# EAGLE schematic raspi_zero_power_sensor_hat (EAGLE 7.7.0)
Assembly variants: POR, PCB_ONLY

## Sheet 1 of 7: TITLE_TOC
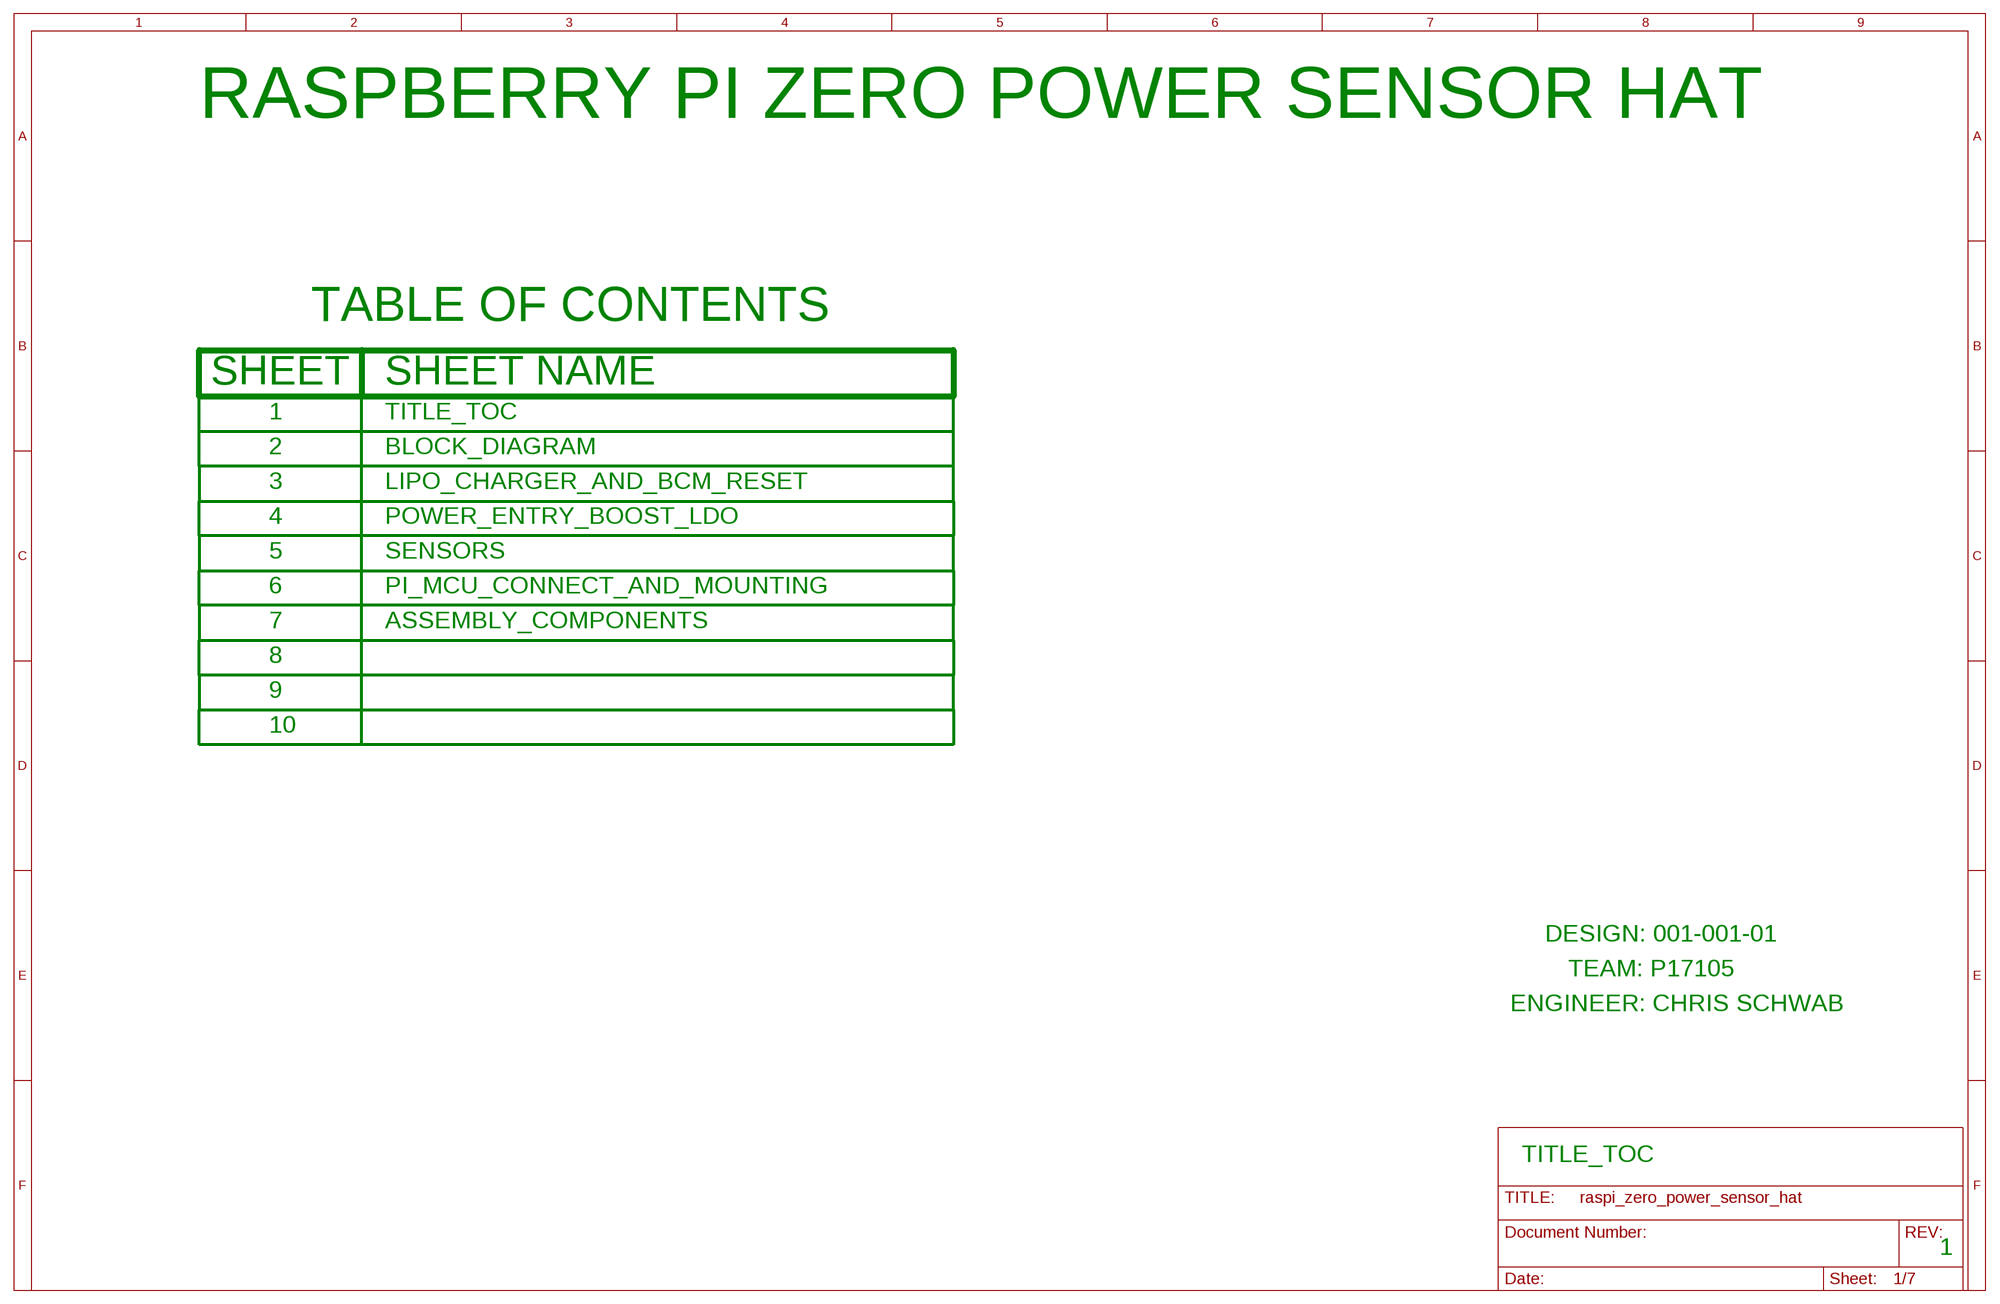
[diagram p0: schematic, sheet 1]

### Notes on the sheet
- RASPBERRY PI ZERO POWER SENSOR HAT
- TITLE_TOC
- BLOCK_DIAGRAM
- LIPO_CHARGER_AND_BCM_RESET
- POWER_ENTRY_BOOST_LDO
- SENSORS
- PI_MCU_CONNECT_AND_MOUNTING
- ASSEMBLY_COMPONENTS
- DESIGN: 001-001-01
- TEAM: P17105
- ENGINEER: CHRIS SCHWAB
- TITLE_TOC
- 1

## Sheet 2 of 7: BLOCK_DIAGRAM
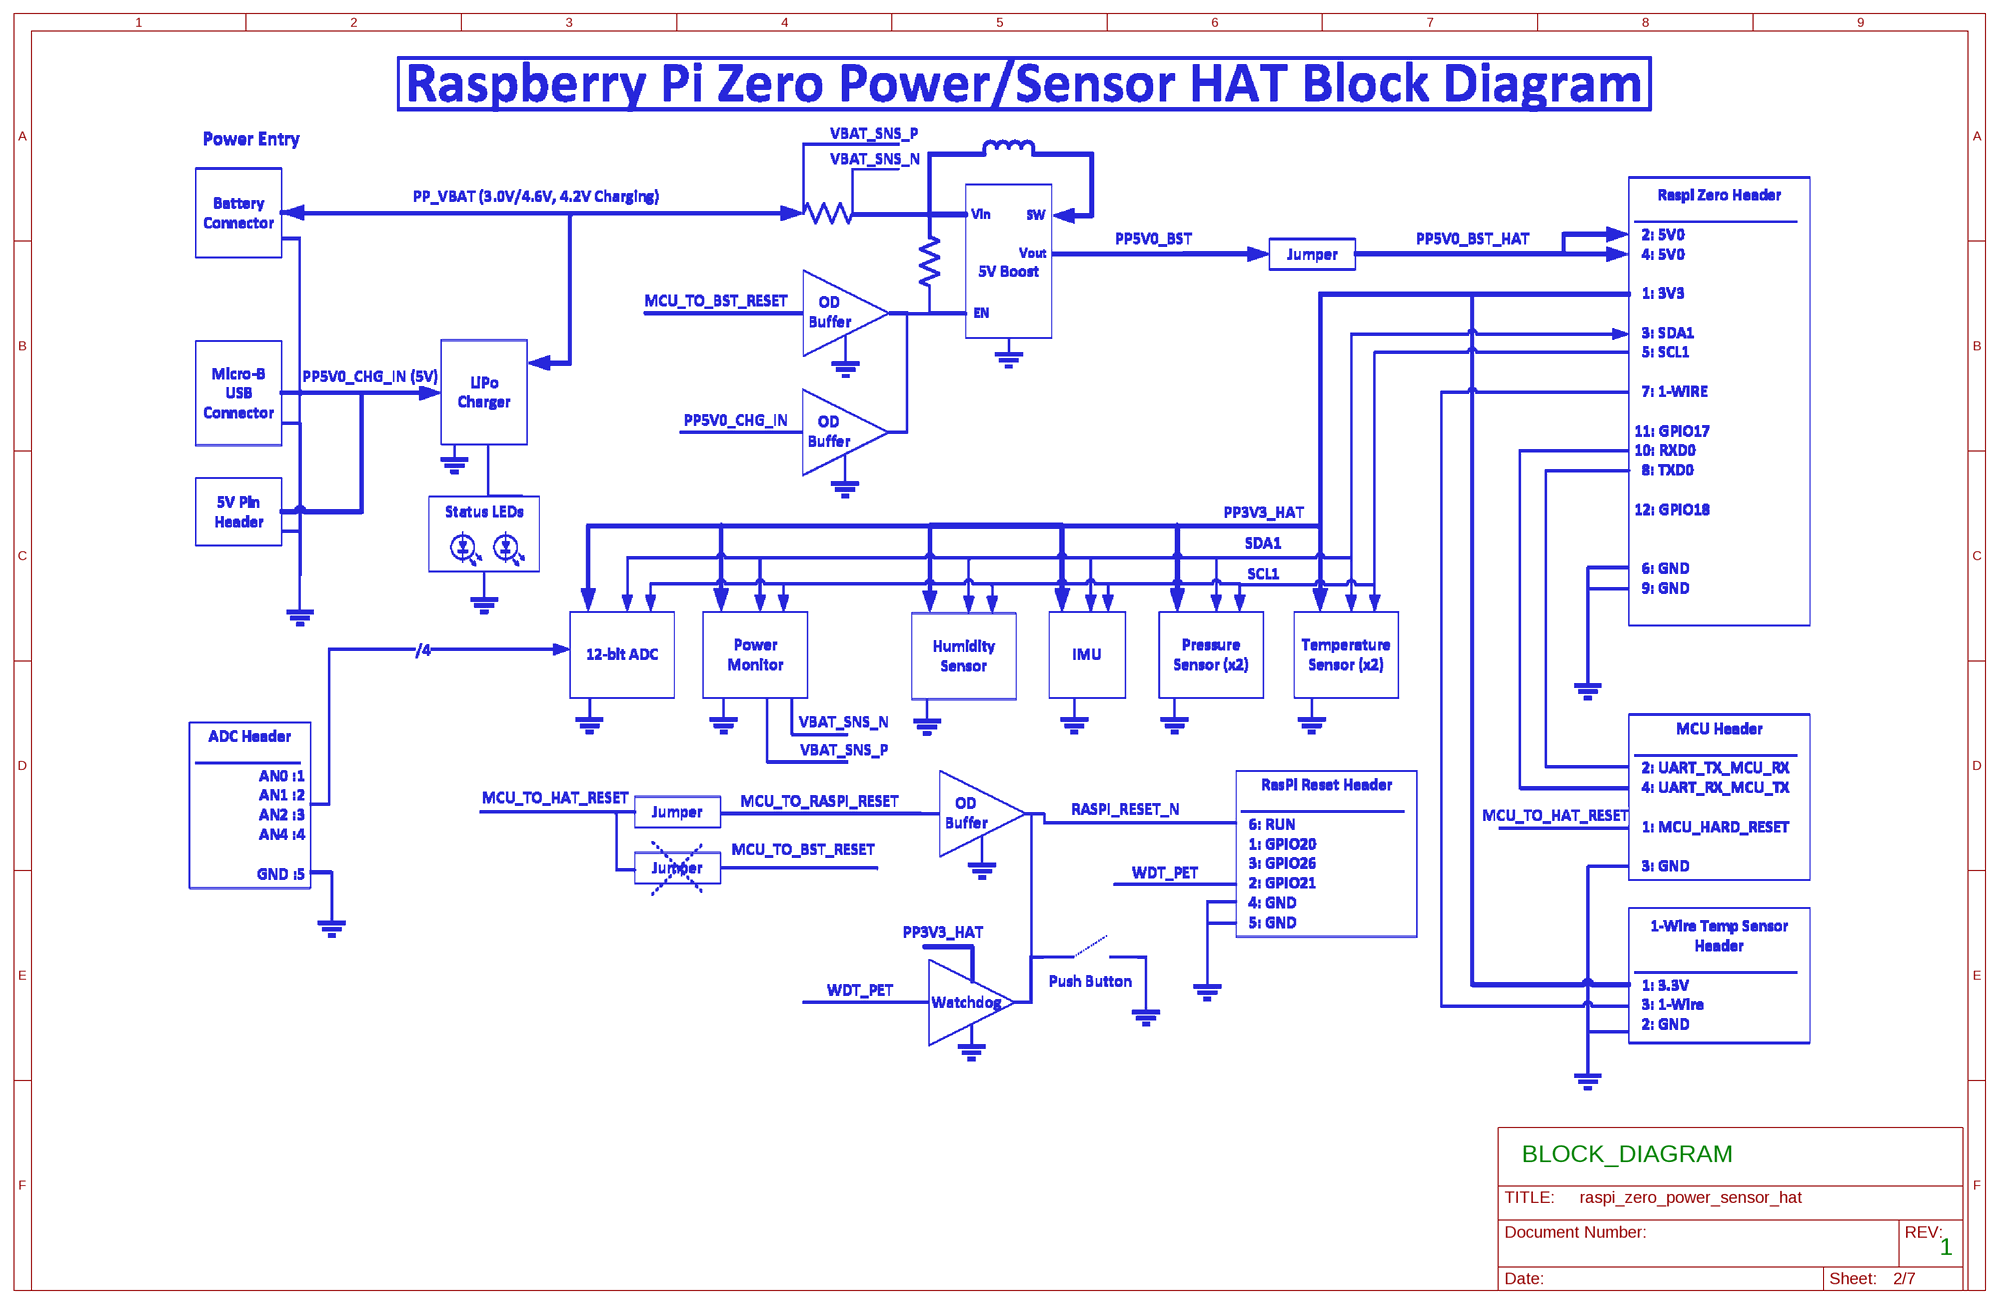
[diagram p1: schematic, sheet 2]

### Notes on the sheet
- BLOCK_DIAGRAM
- 1

## Sheet 3 of 7: LIPO_CHARGER
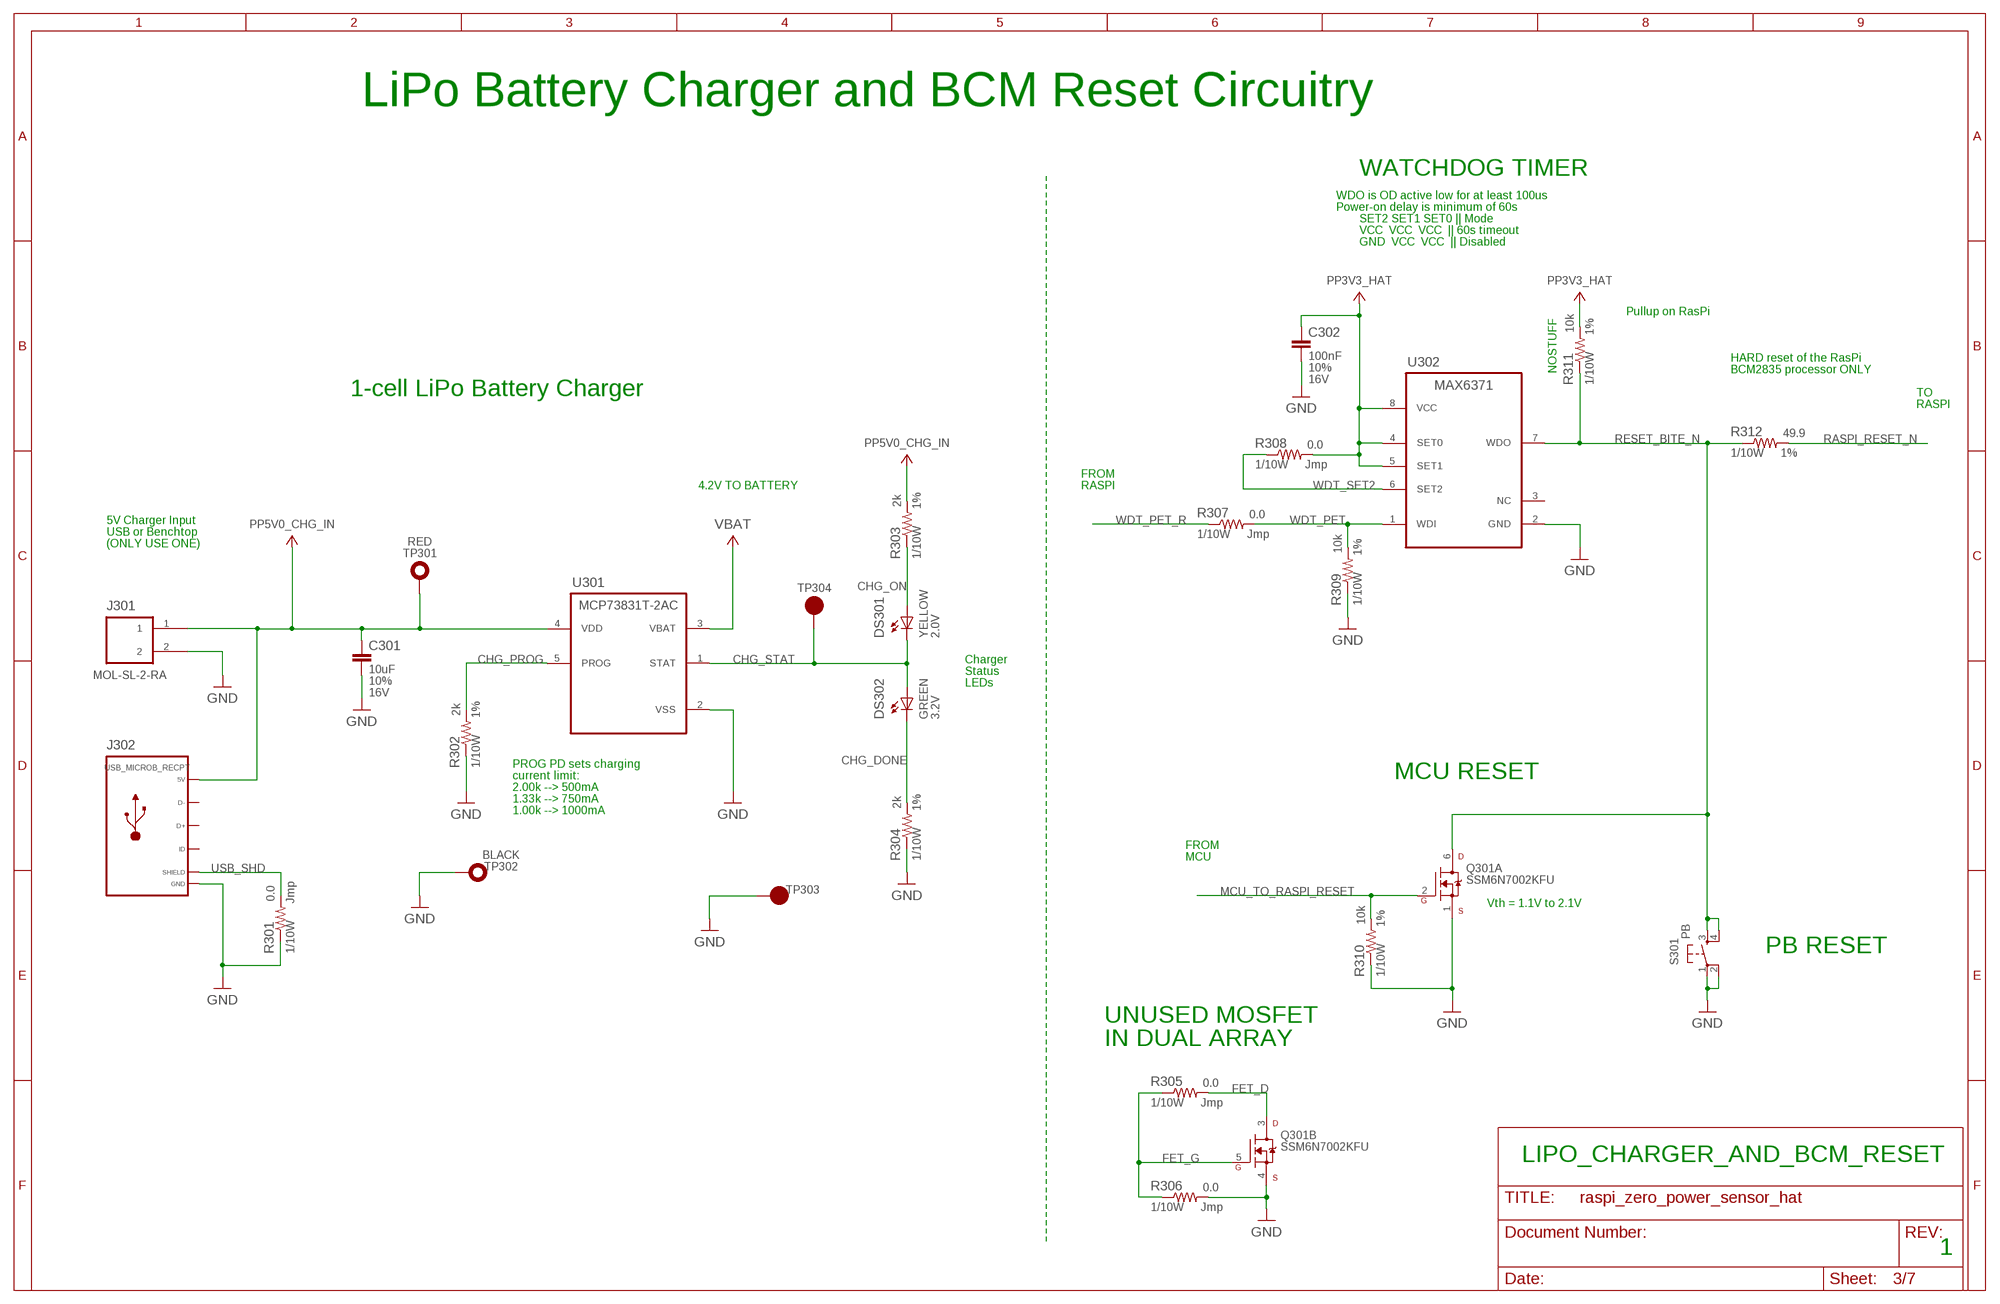
[diagram p2: schematic, sheet 3]

### Parts
C301  10uF  CAP_10UF0_0805_0805  [C0805]
C302  100nF  CAP_100NF0_0603  [C0603]
DS301  YELLOW  LED_Y2V0WURTH_0603  [LED0603]
DS302  GREEN  LED_G3V2WURTH_0603  [LED0603]
J301  MOL-SL-2-RA  MOLSL_2PIN_RAH  [MOLSL-2-RA_HALF]
J302  USB_MICROB_RECPT  USB_B_MICRO_RIGHT  [MICROUSB-RIGHT]
Q301  SSM6N7002KFU  MOSFET-NCHANNEL_DUAL_DUAL_SOT363  [SOT363P080X040-6N]
R301  0.0  RES_0R0_0603  [R0603]
R302  2k  RES_2R0_0603  [R0603]
R303  2k  RES_2R0_0603  [R0603]
R304  2k  RES_2R0_0603  [R0603]
R305  0.0  RES_0R0_0603  [R0603]
R306  0.0  RES_0R0_0603  [R0603]
R307  0.0  RES_0R0_0603  [R0603]
R308  0.0  RES_0R0_0603  [R0603]
R309  10k  RES_10R0_0603  [R0603]
R310  10k  RES_10R0_0603  [R0603]
R311  10k  RES_10R0_0603  [R0603]  (not fitted in variant POR)  (not fitted in variant PCB_ONLY)
R312  49.9  RES_0R499_0603  [R0603]
S301  PB  PB-TACTILE-4P_B3F-1000_PTH  [TACTILE-PTH]
TP301  TEST_POINT_TH_D102_R  [TP_TH102]
TP302  TEST_POINT_TH_D102_B  [TP_TH102]
TP303  TEST_POINT_SMT_20R_SMD  [TP20R]
TP304  TEST_POINT_SMT_15R_SMD  [TP15R]
U301  MCP73831T-2AC  MCP73831T-2ACI/OT  [SOT23P110X060-5N]
U302  MAX6371  MAX63XX71KA_SOT23  [SOT23P130X045-8N]

### Nets
CHG_DONE: DS302.1(C) R304.2
CHG_ON: DS301.2(A) R303.1
CHG_PROG: R302.2 U301.5(PROG)
CHG_STAT: DS301.1(C) DS302.2(A) TP304.TP U301.1(STAT)
FET_D: Q301.3(B:D) R305.2
FET_G: Q301.5(B:G) R305.1 R306.1
GND: C301.2 C302.2 J301.2 J302.5(GND) Q301.1(A:S) Q301.4(B:S) R301.1 R302.1 R304.1 R306.2 R309.1 R310.1 S301.1 S301.2 TP302.1(TP) TP303.TP U301.2(VSS) U302.2(GND) ; also sheet 4,5,6
MCU_TO_RASPI_RESET: Q301.2(A:G) R310.2 ; also sheet 6
PP3V3_HAT: C302.1 R308.2 R311.2 U302.4(SET0) U302.5(SET1) U302.8(VCC) ; also sheet 4,5,6
PP5V0_CHG_IN: C301.1 J301.1 J302.1(5V) R303.2 TP301.1(TP) U301.4(VDD) ; also sheet 4
RASPI_RESET_N: R312.2 ; also sheet 6
RESET_BITE_N: Q301.6(A:D) R311.1 R312.1 S301.3 S301.4 U302.7(WDO)
USB_SHD: J302.S1(SLD) J302.S2(SLD) J302.S3(SLD) J302.S4(SLD) J302.S5(SLD) J302.S6(SLD) R301.2
VBAT: U301.3(VBAT) ; also sheet 4
WDT_PET: R307.2 R309.2 U302.1(WDI)
WDT_PET_R: R307.1 ; also sheet 6
WDT_SET2: R308.1 U302.6(SET2)
Unconnected: J302.2(D-) J302.3(D+) J302.4(ID) U302.3(NC)

### Notes on the sheet
- LiPo Battery Charger and BCM Reset Circuitry
- WATCHDOG TIMER
- WDO is OD active low for at least 100us
- Power-on delay is minimum of 60s
- SET2 SET1 SET0 || Mode
- VCC  VCC  VCC  || 60s timeout
- GND  VCC  VCC  || Disabled
- Pullup on RasPi
- HARD reset of the RasPi
- NOSTUFF | BCM2835 processor ONLY
- 1-cell LiPo Battery Charger | TO
- RASPI
- FROM
- 4.2V TO BATTERY | RASPI
- 5V Charger Input
- USB or Benchtop
- (ONLY USE ONE)
- Charger
- Status
- LEDs
- PROG PD sets charging
- current limit: | MCU RESET
- 2.00k --> 500mA
- 1.33k --> 750mA
- 1.00k --> 1000mA
- FROM
- MCU
- Vth = 1.1V to 2.1V
- PB RESET
- UNUSED MOSFET
- IN DUAL ARRAY
- LIPO_CHARGER_AND_BCM_RESET
- 1

## Sheet 4 of 7: POWER_ENTRY_BOOST_LDO
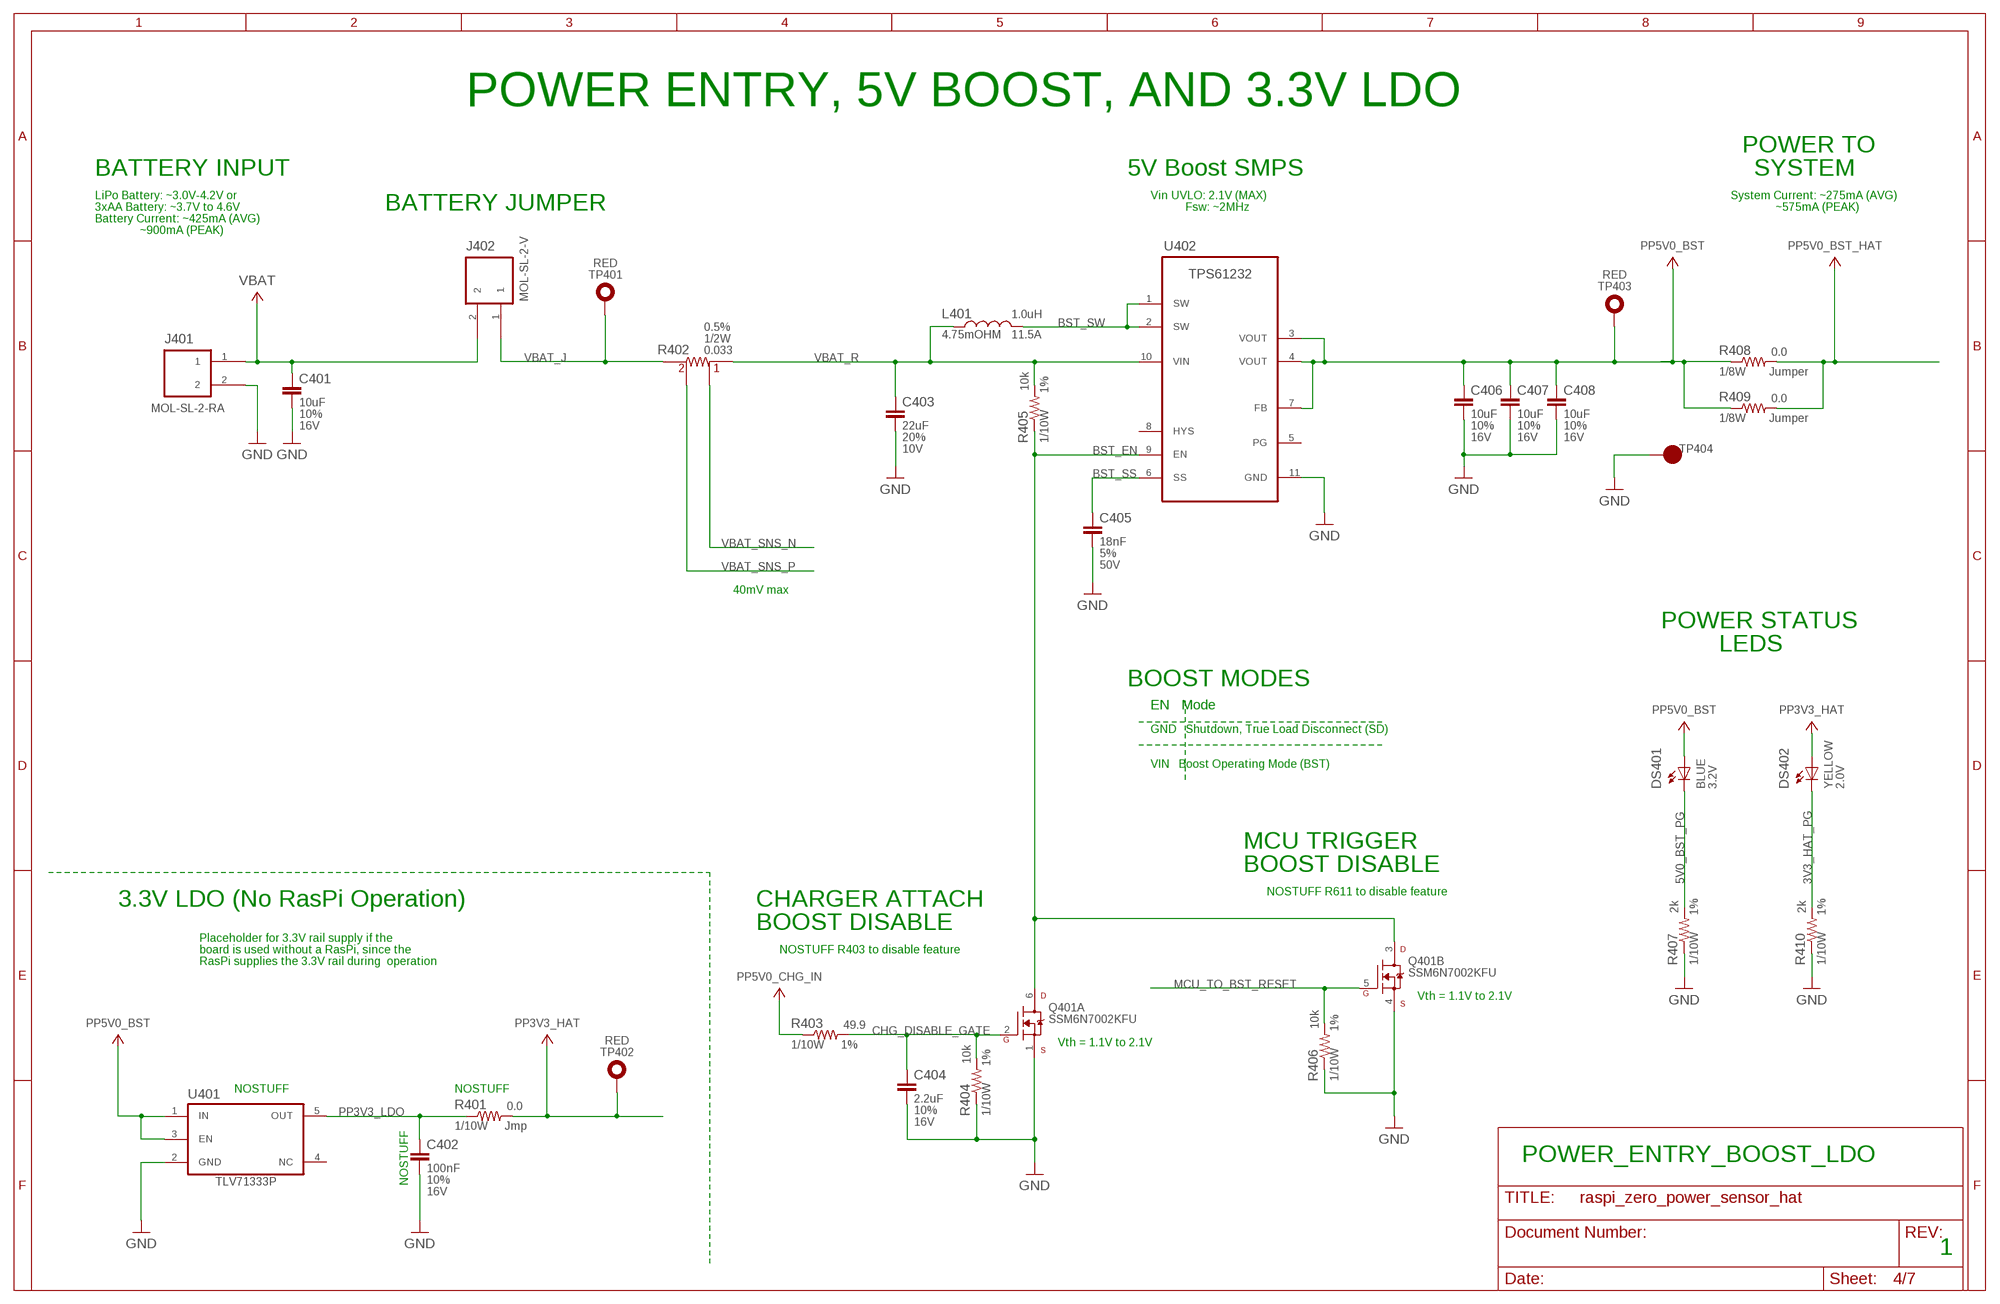
[diagram p3: schematic, sheet 4]

### Parts
C401  10uF  CAP_10UF0_0805_0805  [C0805]
C402  100nF  CAP_100NF0_0603  [C0603]  (not fitted in variant POR)  (not fitted in variant PCB_ONLY)
C403  22uF  CAP_22UF0_0805  [C0805]
C404  2.2uF  CAP_2UF2_0603  [C0603]  (not fitted in variant POR)  (not fitted in variant PCB_ONLY)
C405  18nF  CAP_18NF0_0603  [C0603]
C406  10uF  CAP_10UF0_0805_0805  [C0805]
C407  10uF  CAP_10UF0_0805_0805  [C0805]
C408  10uF  CAP_10UF0_0805_0805  [C0805]
DS401  BLUE  LED_B3V2WURTH_0603  [LED0603]
DS402  YELLOW  LED_Y2V0WURTH_0603  [LED0603]
J401  MOL-SL-2-RA  MOLSL_2PIN_SL2RA_RA  [MOLSL-2-RA]
J402  MOL-SL-2-V  MOLSL_2PIN_SL2V_V  [MOLSL-2-V]
L401  1.0uH  L_1UH0_2SMD3  [SMD410P190X160-2N]
Q401  SSM6N7002KFU  MOSFET-NCHANNEL_DUAL_DUAL_SOT363  [SOT363P080X040-6N]
R401  0.0  RES_0R0_0603  [R0603]  (not fitted in variant POR)  (not fitted in variant PCB_ONLY)
R402  0.033  RES_SNS_0RS033  [RS1206]
R403  49.9  RES_0R499_0603  [R0603]
R404  10k  RES_10R0_0603  [R0603]
R405  10k  RES_10R0_0603  [R0603]
R406  10k  RES_10R0_0603  [R0603]
R407  2k  RES_2R0_0603  [R0603]
R408  0.0  RES_0R0_0805_0805  [R0805]
R409  0.0  RES_0R0_0805_0805  [R0805]
R410  2k  RES_2R0_0603  [R0603]
TP401  TEST_POINT_TH_D102_R  [TP_TH102]
TP402  TEST_POINT_TH_D102_R  [TP_TH102]
TP403  TEST_POINT_TH_D102_R  [TP_TH102]
TP404  TEST_POINT_SMT_15R_SMD  [TP15R]
U401  TLV71333P  TLV71333PDBVR_SOT23  [SOT23P105X060-5N]  (not fitted in variant POR)  (not fitted in variant PCB_ONLY)
U402  TPS61232  TPS61232_SM  [DRC0010G_SM]

### Nets
3V3_HAT_PG: DS402.1(C) R410.2
5V0_BST_PG: DS401.1(C) R407.2
BST_EN: Q401.3(B:D) Q401.6(A:D) R405.1 U402.9(EN)
BST_SS: C405.1 U402.6(SS)
BST_SW: L401.2 U402.1(SW) U402.2(SW)
CHG_DISABLE_GATE: C404.1 Q401.2(A:G) R403.2 R404.2
GND: C401.2 C402.2 C403.2 C404.2 C405.2 C406.2 C407.2 C408.2 J401.2 Q401.1(A:S) Q401.4(B:S) R404.1 R406.1 R407.1 R410.1 TP404.TP U401.2(GND) U402.11(GND) ; also sheet 3,5,6
MCU_TO_BST_RESET: Q401.5(B:G) R406.2 ; also sheet 6
PP3V3_HAT: DS402.2(A) R401.2 TP402.1(TP) ; also sheet 3,5,6
PP3V3_LDO: C402.1 R401.1 U401.5(OUT)
PP5V0_BST: C406.1 C407.1 C408.1 DS401.2(A) R408.1 R409.1 TP403.1(TP) U401.1(IN) U401.3(EN) U402.3(VOUT) U402.4(VOUT) U402.7(FB)
PP5V0_BST_HAT: R408.2 R409.2 ; also sheet 6
PP5V0_CHG_IN: R403.1 ; also sheet 3
VBAT: C401.1 J401.1 J402.2 ; also sheet 3
VBAT_J: J402.1 R402.2A TP401.1(TP)
VBAT_R: C403.1 L401.1 R402.1A R405.2 U402.10(VIN)
VBAT_SNS_N [diff_pair]: R402.1V ; also sheet 5
VBAT_SNS_P [diff_pair]: R402.2V ; also sheet 5
Unconnected: U401.4(NC) U402.5(PG) U402.8(HYS)

### Notes on the sheet
- POWER ENTRY, 5V BOOST, AND 3.3V LDO
- POWER TO
- BATTERY INPUT | 5V Boost SMPS | SYSTEM
- LiPo Battery: ~3.0V-4.2V or | Vin UVLO: 2.1V (MAX) | System Current: ~275mA (AVG)
- 3xAA Battery: ~3.7V to 4.6V | BATTERY JUMPER | Fsw: ~2MHz | ~575mA (PEAK)
- Battery Current: ~425mA (AVG)
- ~900mA (PEAK)
- 40mV max
- POWER STATUS
- LEDS
- BOOST MODES
- EN   Mode
- GND   Shutdown, True Load Disconnect (SD)
- VIN   Boost Operating Mode (BST)
- MCU TRIGGER
- BOOST DISABLE
- NOSTUFF R611 to disable feature
- 3.3V LDO (No RasPi Operation) | CHARGER ATTACH
- BOOST DISABLE
- Placeholder for 3.3V rail supply if the
- board is used without a RasPi, since the | NOSTUFF R403 to disable feature
- RasPi supplies the 3.3V rail during  operation
- Vth = 1.1V to 2.1V
- Vth = 1.1V to 2.1V
- NOSTUFF | NOSTUFF
- POWER_ENTRY_BOOST_LDO
- NOSTUFF
- 1

## Sheet 5 of 7: SENSORS
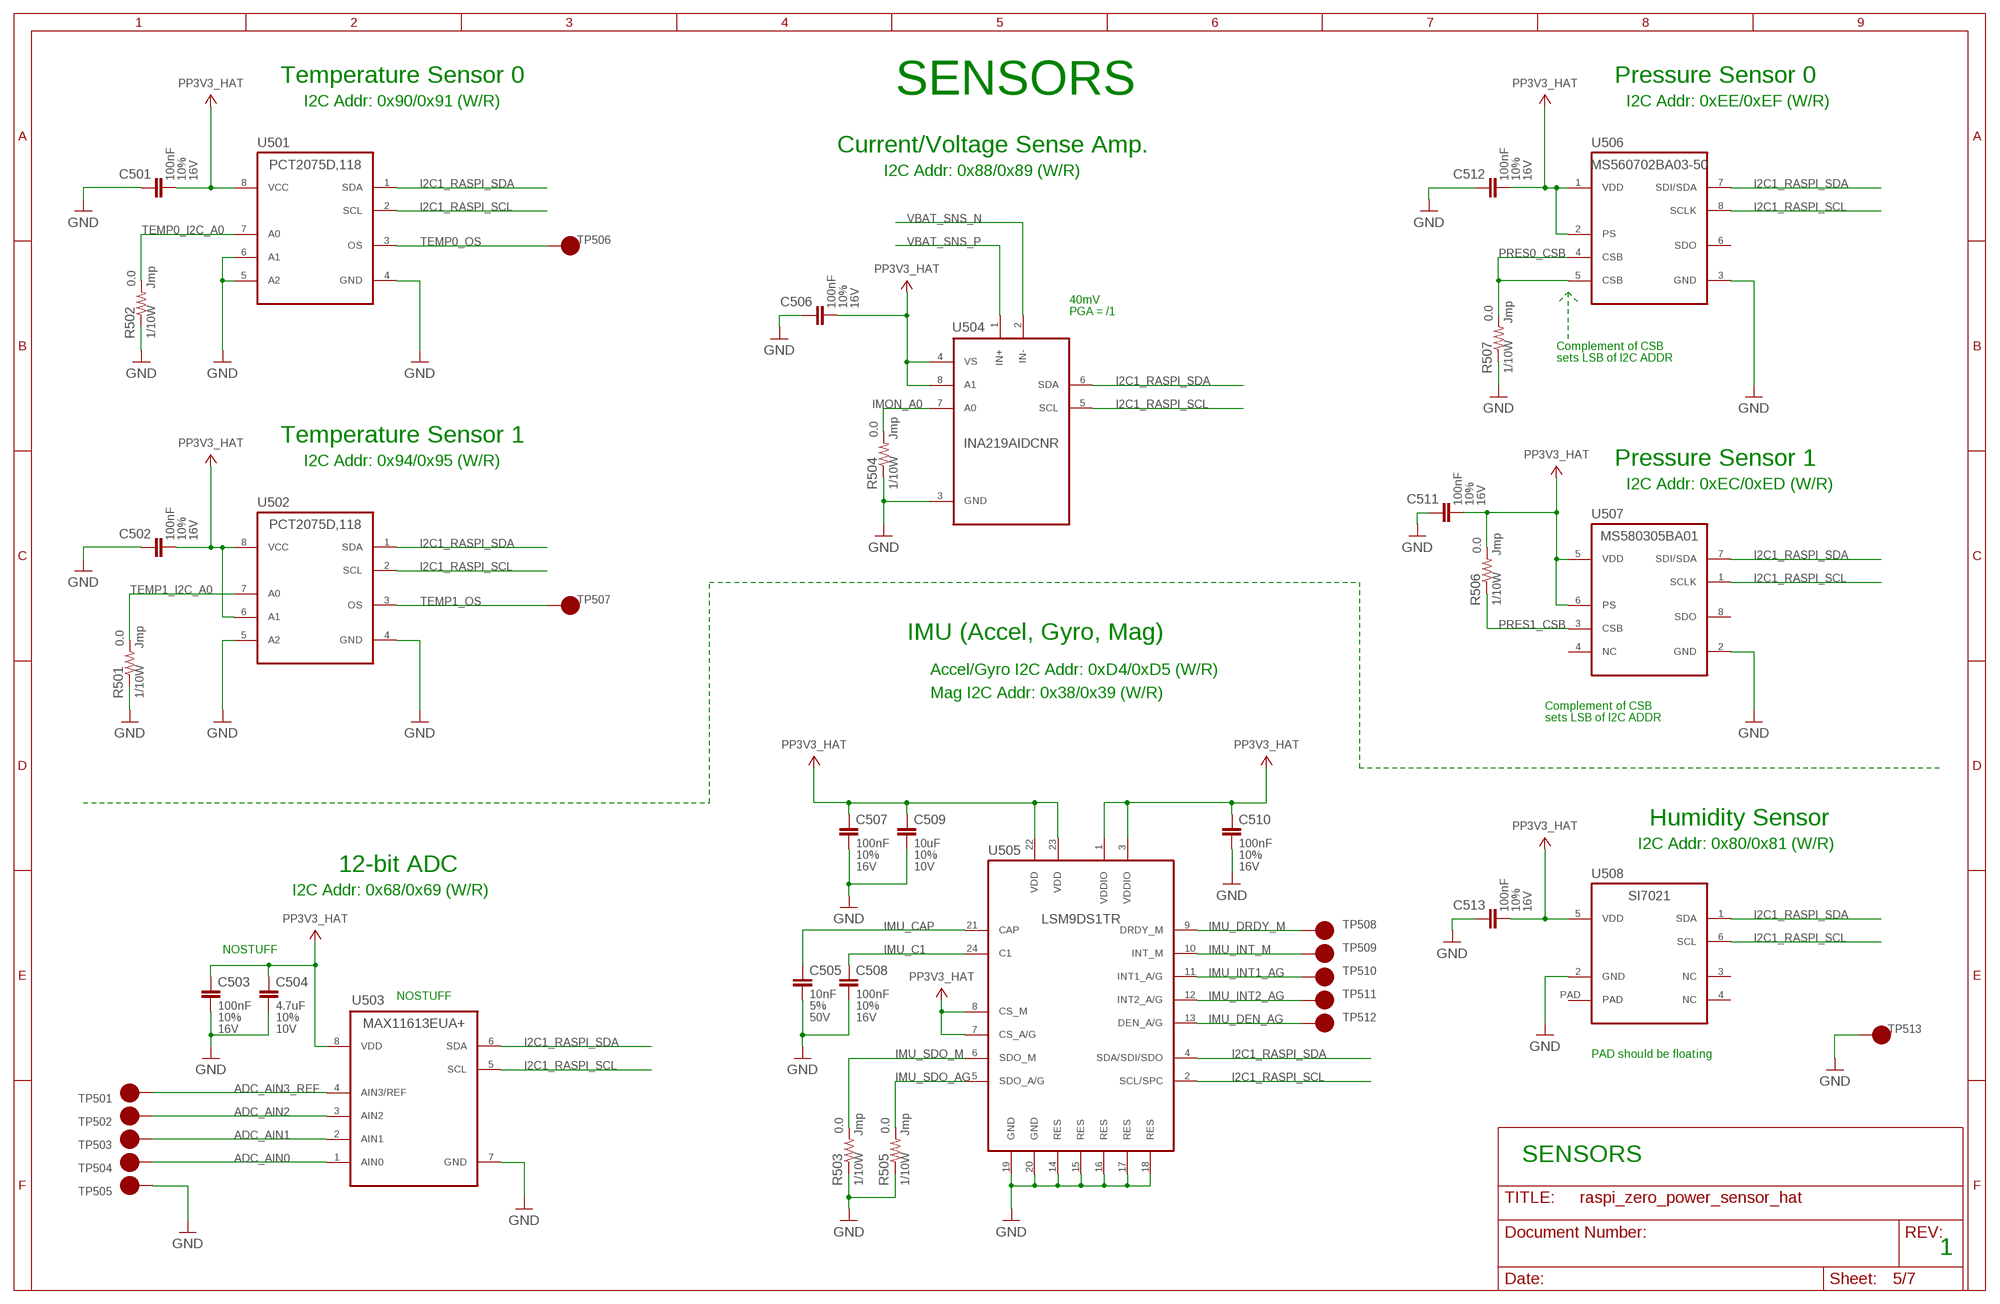
[diagram p4: schematic, sheet 5]

### Parts
C501  100nF  CAP_100NF0_0603  [C0603]
C502  100nF  CAP_100NF0_0603  [C0603]
C503  100nF  CAP_100NF0_0603  [C0603]  (not fitted in variant POR)  (not fitted in variant PCB_ONLY)
C504  4.7uF  CAP_4UF7_0603_0603  [C0603]  (not fitted in variant POR)  (not fitted in variant PCB_ONLY)
C505  10nF  CAP_10NF0_0603  [C0603]
C506  100nF  CAP_100NF0_0603  [C0603]
C507  100nF  CAP_100NF0_0603  [C0603]
C508  100nF  CAP_100NF0_0603  [C0603]
C509  10uF  CAP_10UF0_0603  [C0603]
C510  100nF  CAP_100NF0_0603  [C0603]
C511  100nF  CAP_100NF0_0603  [C0603]
C512  100nF  CAP_100NF0_0603  [C0603]
C513  100nF  CAP_100NF0_0603  [C0603]
R501  0.0  RES_0R0_0603  [R0603]
R502  0.0  RES_0R0_0603  [R0603]
R503  0.0  RES_0R0_0603  [R0603]
R504  0.0  RES_0R0_0603  [R0603]
R505  0.0  RES_0R0_0603  [R0603]
R506  0.0  RES_0R0_0603  [R0603]
R507  0.0  RES_0R0_0603  [R0603]
TP501  TEST_POINT_SMT_20R_SMD  [TP20R]
TP502  TEST_POINT_SMT_20R_SMD  [TP20R]
TP503  TEST_POINT_SMT_20R_SMD  [TP20R]
TP504  TEST_POINT_SMT_20R_SMD  [TP20R]
TP505  TEST_POINT_SMT_20R_SMD  [TP20R]
TP506  TEST_POINT_SMT_15R_SMD  [TP15R]
TP507  TEST_POINT_SMT_15R_SMD  [TP15R]
TP508  TEST_POINT_SMT_15R_SMD  [TP15R]
TP509  TEST_POINT_SMT_15R_SMD  [TP15R]
TP510  TEST_POINT_SMT_15R_SMD  [TP15R]
TP511  TEST_POINT_SMT_15R_SMD  [TP15R]
TP512  TEST_POINT_SMT_15R_SMD  [TP15R]
TP513  TEST_POINT_SMT_20R_SMD  [TP20R]
U501  PCT2075D,118  PCT2075DD,118SOIC8  [SOIC127P130X0600-8N]
U502  PCT2075D,118  PCT2075DD,118SOIC8  [SOIC127P130X0600-8N]
U503  MAX11613EUA+  [SOP65P135X040-8N]  (not fitted in variant POR)  (not fitted in variant PCB_ONLY)
U504  INA219AIDCNR  [SOT65P110X045-8N]
U505  LSM9DS1TR  LSM9DS1TR_LGA24  [LGA043P045X033-24N]
U506  MS560702BA03-50  MS5607-02BA03_8SMD  [SMD125P110X060-8N]
U507  MS580305BA01  MS5803-05BA_8SMD  [SMD125130P225X090-8N]
U508  SI7021  SI7021-A20-IM_DFN6  [DFN-100P085X045-T-6N]

### Nets
ADC_AIN0: TP504.TP U503.1(AIN0)
ADC_AIN1: TP503.TP U503.2(AIN1)
ADC_AIN2: TP502.TP U503.3(AIN2)
ADC_AIN3_REF: TP501.TP U503.4(AIN3/REF)
GND: C501.1 C502.1 C503.2 C504.2 C505.2 C506.1 C507.2 C508.2 C509.2 C510.2 C511.1 C512.1 C513.1 R501.1 R502.1 R503.1 R504.1 R505.1 R507.1 TP505.TP TP513.TP U501.4(GND) U501.5(A2) U501.6(A1) U502.4(GND) U502.5(A2) U503.7(GND) U504.3(GND) U505.14(RES) U505.15(RES) U505.16(RES) U505.17(RES) U505.18(RES) U505.19(GND) U505.20(GND) U506.3(GND) U507.2(GND) U508.2(GND) ; also sheet 3,4,6
I2C1_RASPI_SCL: U501.2(SCL) U502.2(SCL) U503.5(SCL) U504.5(SCL) U505.2(SCL/SPC) U506.8(SCLK) U507.1(SCLK) U508.6(SCL) ; also sheet 6
I2C1_RASPI_SDA: U501.1(SDA) U502.1(SDA) U503.6(SDA) U504.6(SDA) U505.4(SDA/SDI/SDO) U506.7(SDI/SDA) U507.7(SDI/SDA) U508.1(SDA) ; also sheet 6
IMON_A0: R504.2 U504.7(A0)
IMU_C1: C508.1 U505.24(C1)
IMU_CAP: C505.1 U505.21(CAP)
IMU_DEN_AG: TP512.TP U505.13(DEN_A/G)
IMU_DRDY_M: TP508.TP U505.9(DRDY_M)
IMU_INT1_AG: TP510.TP U505.11(INT1_A/G)
IMU_INT2_AG: TP511.TP U505.12(INT2_A/G)
IMU_INT_M: TP509.TP U505.10(INT_M)
IMU_SDO_AG: R505.2 U505.5(SDO_A/G)
IMU_SDO_M: R503.2 U505.6(SDO_M)
PP3V3_HAT: C501.2 C502.2 C503.1 C504.1 C506.2 C507.1 C509.1 C510.1 C511.2 C512.2 C513.2 R506.2 U501.8(VCC) U502.6(A1) U502.8(VCC) U503.8(VDD) U504.4(VS) U504.8(A1) U505.1(VDDIO) U505.3(VDDIO) U505.7(CS_A/G) U505.8(CS_M) U505.22(VDD) U505.23(VDD) U506.1(VDD) U506.2(PS) U507.5(VDD) U507.6(PS) U508.5(VDD) ; also sheet 3,4,6
PRES0_CSB: R507.2 U506.4(CSB) U506.5(CSB)
PRES1_CSB: R506.1 U507.3(CSB)
TEMP0_I2C_A0: R502.2 U501.7(A0)
TEMP0_OS: TP506.TP U501.3(OS)
TEMP1_I2C_A0: R501.2 U502.7(A0)
TEMP1_OS: TP507.TP U502.3(OS)
VBAT_SNS_N [diff_pair]: U504.2(IN-) ; also sheet 4
VBAT_SNS_P [diff_pair]: U504.1(IN+) ; also sheet 4
Unconnected: U506.6(SDO) U507.4(NC) U507.8(SDO) U508.3(NC) U508.4(NC) U508.PAD

### Notes on the sheet
- Temperature Sensor 0 | Pressure Sensor 0
- SENSORS
- I2C Addr: 0x90/0x91 (W/R) | I2C Addr: 0xEE/0xEF (W/R)
- Current/Voltage Sense Amp.
- I2C Addr: 0x88/0x89 (W/R)
- 40mV
- PGA = /1
- Complement of CSB
- sets LSB of I2C ADDR
- Temperature Sensor 1
- I2C Addr: 0x94/0x95 (W/R) | Pressure Sensor 1
- I2C Addr: 0xEC/0xED (W/R)
- IMU (Accel, Gyro, Mag)
- Accel/Gyro I2C Addr: 0xD4/0xD5 (W/R)
- Mag I2C Addr: 0x38/0x39 (W/R)
- Complement of CSB
- sets LSB of I2C ADDR
- Humidity Sensor
- I2C Addr: 0x80/0x81 (W/R)
- 12-bit ADC
- I2C Addr: 0x68/0x69 (W/R)
- NOSTUFF
- NOSTUFF
- PAD should be floating
- SENSORS
- 1

## Sheet 6 of 7: PI_MCU_CONNECT_AND_MOUNTING
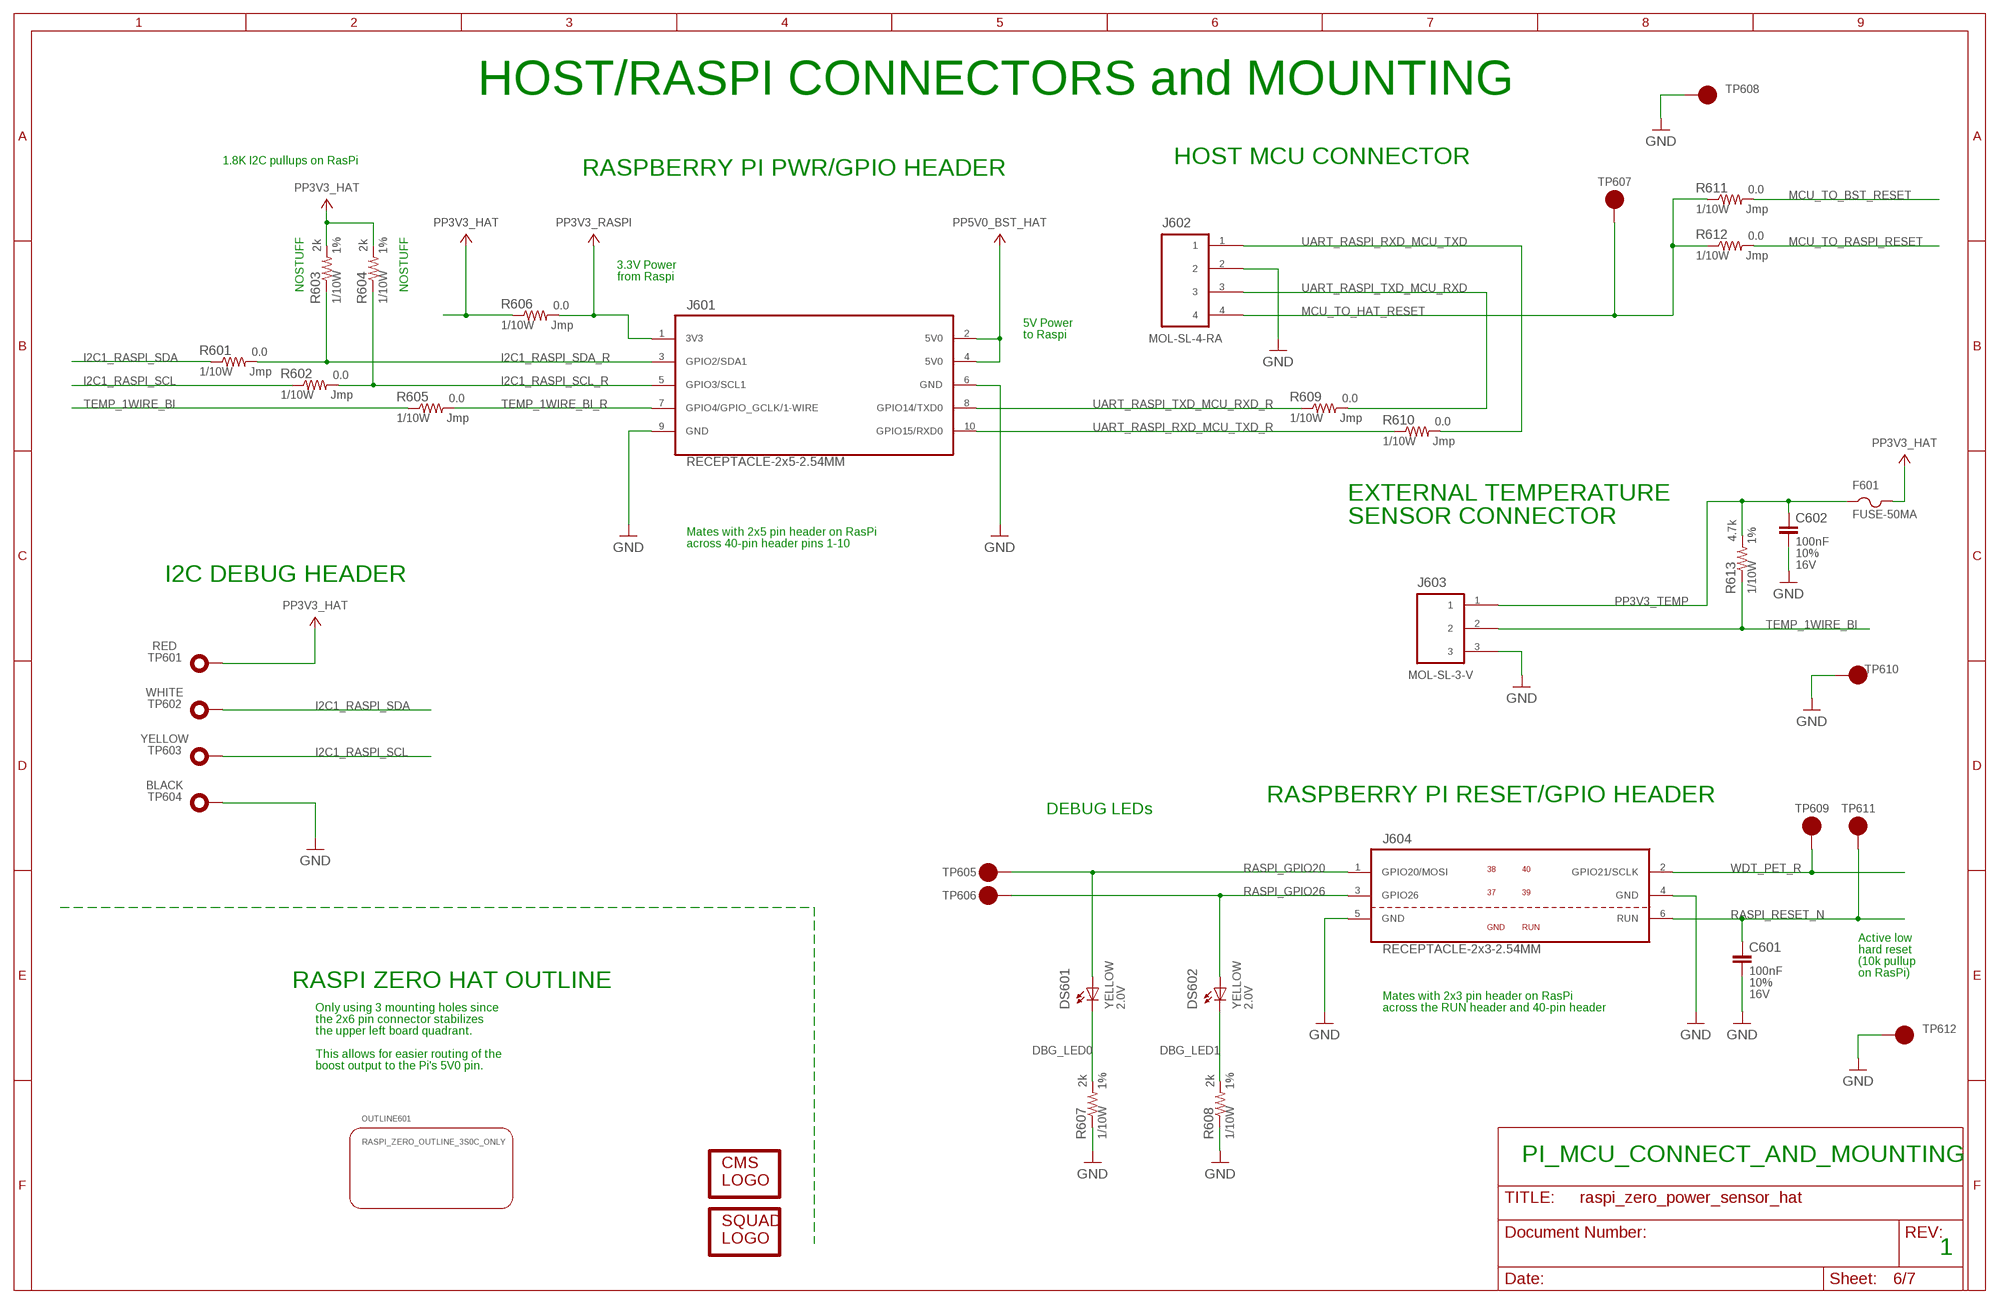
[diagram p5: schematic, sheet 6]

### Parts
C601  100nF  CAP_100NF0_0603  [C0603]
C602  100nF  CAP_100NF0_0603  [C0603]
DS601  YELLOW  LED_Y2V0WURTH_0603  [LED0603]
DS602  YELLOW  LED_Y2V0WURTH_0603  [LED0603]
F601  FUSE-50MA  FUSE_CHIP_0603  [R0603]
J601  RECEPTACLE-2x5-2.54MM  RECEPTICAL-2X5-254MM-PIZERO_TH  [RECEPTACLE-2X5-254MM]
J602  MOL-SL-4-RA  MOLSL_4PIN_RAH  [MOLSL-4-RA_HALF]
J603  MOL-SL-3-V  MOLSL_3PIN_SL3V_V  [MOLSL-3-V]
J604  RECEPTACLE-2x3-2.54MM  RECEPTICAL-2X3-254MM-PIZERO-RUN_2X3_254MM_TH  [RECEPTACLE-2X3-254MM]
LOGO601  CMS_LOGO  [CMS_LOGO]
LOGO602  SQUAD_LOGO  [SQUAD_LOGO]
OUTLINE601  RASPI_ZERO_OUTLINE_3S0C_ONLY  [RASPI_ZERO_3STANDOFFS_ONLY]
R601  0.0  RES_0R0_0603  [R0603]
R602  0.0  RES_0R0_0603  [R0603]
R603  2k  RES_2R0_0603  [R0603]  (not fitted in variant POR)  (not fitted in variant PCB_ONLY)
R604  2k  RES_2R0_0603  [R0603]  (not fitted in variant POR)  (not fitted in variant PCB_ONLY)
R605  0.0  RES_0R0_0603  [R0603]
R606  0.0  RES_0R0_0603  [R0603]
R607  2k  RES_2R0_0603  [R0603]
R608  2k  RES_2R0_0603  [R0603]
R609  0.0  RES_0R0_0603  [R0603]
R610  0.0  RES_0R0_0603  [R0603]
R611  0.0  RES_0R0_0603  [R0603]
R612  0.0  RES_0R0_0603  [R0603]  (not fitted in variant POR)  (not fitted in variant PCB_ONLY)
R613  4.7k  RES_4R7_0603  [R0603]
TP601  TEST_POINT_TH_D102_R  [TP_TH102]
TP602  TEST_POINT_TH_D102_W  [TP_TH102]
TP603  TEST_POINT_TH_D102_Y  [TP_TH102]
TP604  TEST_POINT_TH_D102_B  [TP_TH102]
TP605  TEST_POINT_SMT_15R_SMD  [TP15R]
TP606  TEST_POINT_SMT_15R_SMD  [TP15R]
TP607  TEST_POINT_SMT_15R_SMD  [TP15R]
TP608  TEST_POINT_SMT_15R_SMD  [TP15R]
TP609  TEST_POINT_SMT_15R_SMD  [TP15R]
TP610  TEST_POINT_SMT_15R_SMD  [TP15R]
TP611  TEST_POINT_SMT_15R_SMD  [TP15R]
TP612  TEST_POINT_SMT_15R_SMD  [TP15R]

### Nets
DBG_LED0: DS601.1(C) R607.2
DBG_LED1: DS602.1(C) R608.2
GND: C601.2 C602.2 J601.6(GND) J601.9(GND) J602.2 J603.3 J604.4(GND) J604.5(GND) R607.1 R608.1 TP604.1(TP) TP608.TP TP610.TP TP612.TP ; also sheet 3,4,5
I2C1_RASPI_SCL: R602.1 TP603.1(TP) ; also sheet 5
I2C1_RASPI_SCL_R: J601.5(GPIO3/SCL1) R602.2 R604.1
I2C1_RASPI_SDA: R601.1 TP602.1(TP) ; also sheet 5
I2C1_RASPI_SDA_R: J601.3(GPIO2/SDA1) R601.2 R603.1
MCU_TO_BST_RESET: R611.2 ; also sheet 4
MCU_TO_HAT_RESET: J602.4 R611.1 R612.1 TP607.TP
MCU_TO_RASPI_RESET: R612.2 ; also sheet 3
PP3V3_HAT: F601.2 R603.2 R604.2 R606.1 TP601.1(TP) ; also sheet 3,4,5
PP3V3_RASPI: J601.1(3V3) R606.2
PP3V3_TEMP: C602.1 F601.1 J603.1 R613.2
PP5V0_BST_HAT: J601.2(5V0) J601.4(5V0) ; also sheet 4
RASPI_GPIO20: DS601.2(A) J604.1(GPIO20/MOSI) TP605.TP
RASPI_GPIO26: DS602.2(A) J604.3(GPIO26) TP606.TP
RASPI_RESET_N: C601.1 J604.6(RUN) TP611.TP ; also sheet 3
TEMP_1WIRE_BI: J603.2 R605.1 R613.1
TEMP_1WIRE_BI_R: J601.7(GPIO4/GPIO_GCLK/1-WIRE) R605.2
UART_RASPI_RXD_MCU_TXD: J602.1 R610.2
UART_RASPI_RXD_MCU_TXD_R: J601.10(GPIO15/RXD0) R610.1
UART_RASPI_TXD_MCU_RXD: J602.3 R609.2
UART_RASPI_TXD_MCU_RXD_R: J601.8(GPIO14/TXD0) R609.1
WDT_PET_R: J604.2(GPIO21/SCLK) TP609.TP ; also sheet 3

### Notes on the sheet
- HOST/RASPI CONNECTORS and MOUNTING
- 1.8K I2C pullups on RasPi | HOST MCU CONNECTOR
- RASPBERRY PI PWR/GPIO HEADER
- 3.3V Power
- from Raspi
- NOSTUFF | NOSTUFF
- 5V Power
- to Raspi
- EXTERNAL TEMPERATURE
- SENSOR CONNECTOR
- Mates with 2x5 pin header on RasPi
- across 40-pin header pins 1-10
- I2C DEBUG HEADER
- RASPBERRY PI RESET/GPIO HEADER
- DEBUG LEDs
- Active low
- hard reset
- (10k pullup
- on RasPi)
- RASPI ZERO HAT OUTLINE
- Mates with 2x3 pin header on RasPi
- Only using 3 mounting holes since | across the RUN header and 40-pin header
- the 2x6 pin connector stabilizes
- the upper left board quadrant.
- This allows for easier routing of the
- boost output to the Pi's 5V0 pin.
- PI_MCU_CONNECT_AND_MOUNTING
- 1

## Sheet 7 of 7: ASSEMBLY_COMPONENTS
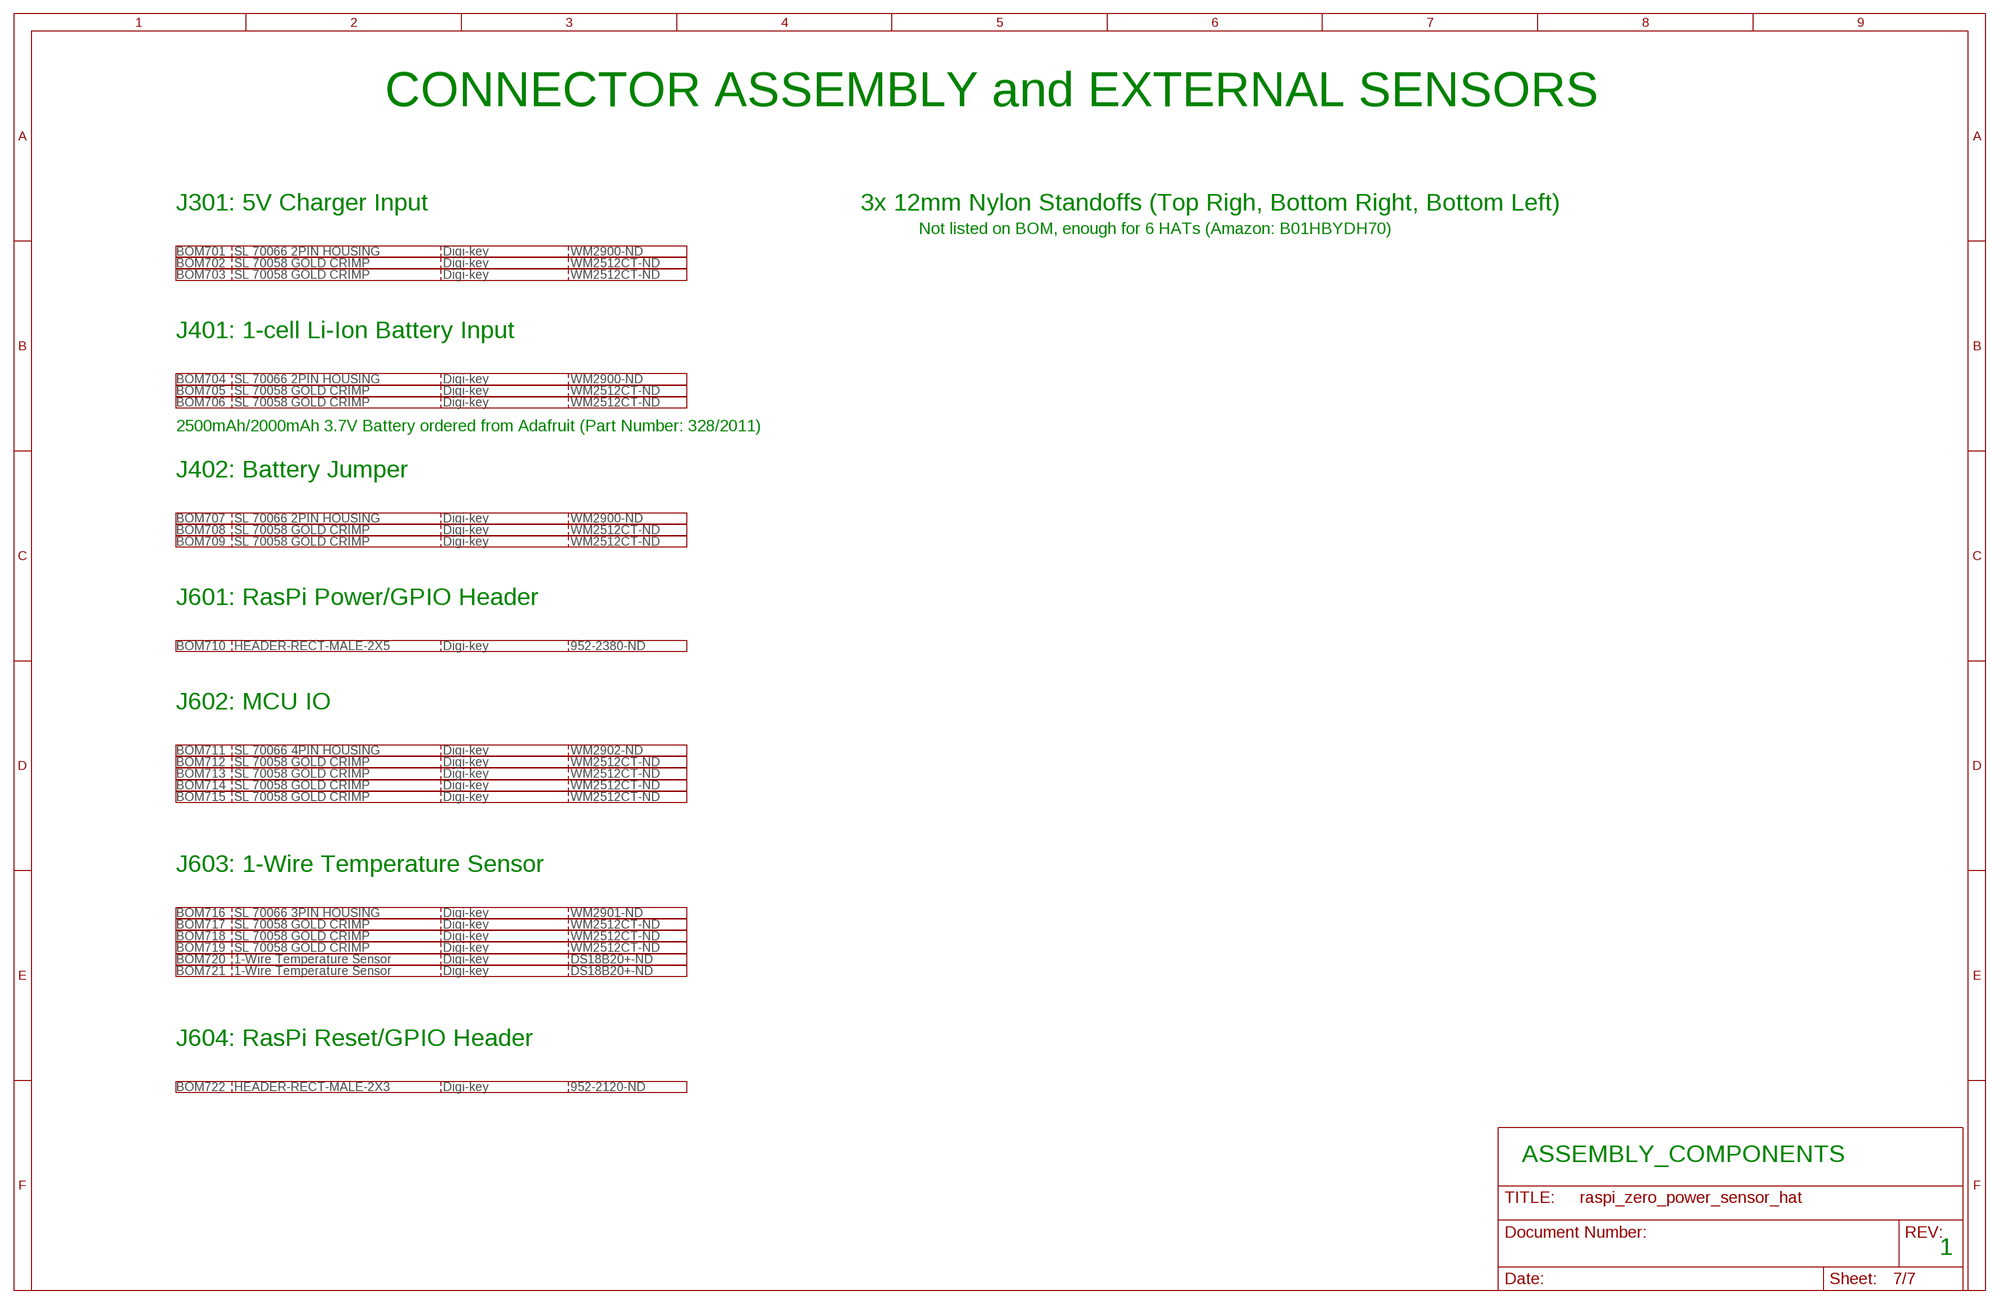
[diagram p6: schematic, sheet 7]

### Parts
BOM701  SL 70066 2PIN HOUSING  BOM_LINE_ITEM_BLI2  [BLANK]  (not fitted in variant PCB_ONLY)
BOM702  SL 70058 GOLD CRIMP  BOM_LINE_ITEM_BLI6  [BLANK]  (not fitted in variant PCB_ONLY)
BOM703  SL 70058 GOLD CRIMP  BOM_LINE_ITEM_BLI6  [BLANK]  (not fitted in variant PCB_ONLY)
BOM704  SL 70066 2PIN HOUSING  BOM_LINE_ITEM_BLI2  [BLANK]  (not fitted in variant PCB_ONLY)
BOM705  SL 70058 GOLD CRIMP  BOM_LINE_ITEM_BLI6  [BLANK]  (not fitted in variant PCB_ONLY)
BOM706  SL 70058 GOLD CRIMP  BOM_LINE_ITEM_BLI6  [BLANK]  (not fitted in variant PCB_ONLY)
BOM707  SL 70066 2PIN HOUSING  BOM_LINE_ITEM_BLI2  [BLANK]  (not fitted in variant PCB_ONLY)
BOM708  SL 70058 GOLD CRIMP  BOM_LINE_ITEM_BLI6  [BLANK]  (not fitted in variant PCB_ONLY)
BOM709  SL 70058 GOLD CRIMP  BOM_LINE_ITEM_BLI6  [BLANK]  (not fitted in variant PCB_ONLY)
BOM710  HEADER-RECT-MALE-2X5  BOM_LINE_ITEM_BLI10  [BLANK]  (not fitted in variant PCB_ONLY)
BOM711  SL 70066 4PIN HOUSING  BOM_LINE_ITEM_BLI4  [BLANK]  (not fitted in variant PCB_ONLY)
BOM712  SL 70058 GOLD CRIMP  BOM_LINE_ITEM_BLI6  [BLANK]  (not fitted in variant PCB_ONLY)
BOM713  SL 70058 GOLD CRIMP  BOM_LINE_ITEM_BLI6  [BLANK]  (not fitted in variant PCB_ONLY)
BOM714  SL 70058 GOLD CRIMP  BOM_LINE_ITEM_BLI6  [BLANK]  (not fitted in variant PCB_ONLY)
BOM715  SL 70058 GOLD CRIMP  BOM_LINE_ITEM_BLI6  [BLANK]  (not fitted in variant PCB_ONLY)
BOM716  SL 70066 3PIN HOUSING  BOM_LINE_ITEM_BLI3  [BLANK]  (not fitted in variant PCB_ONLY)
BOM717  SL 70058 GOLD CRIMP  BOM_LINE_ITEM_BLI6  [BLANK]  (not fitted in variant PCB_ONLY)
BOM718  SL 70058 GOLD CRIMP  BOM_LINE_ITEM_BLI6  [BLANK]  (not fitted in variant PCB_ONLY)
BOM719  SL 70058 GOLD CRIMP  BOM_LINE_ITEM_BLI6  [BLANK]  (not fitted in variant PCB_ONLY)
BOM720  1-Wire Temperature Sensor  BOM_LINE_ITEM_BLI7  [BLANK]  (not fitted in variant PCB_ONLY)
BOM721  1-Wire Temperature Sensor  BOM_LINE_ITEM_BLI7  [BLANK]  (not fitted in variant PCB_ONLY)
BOM722  HEADER-RECT-MALE-2X3  BOM_LINE_ITEM_BLI1  [BLANK]  (not fitted in variant PCB_ONLY)

### Notes on the sheet
- CONNECTOR ASSEMBLY and EXTERNAL SENSORS
- J301: 5V Charger Input | 3x 12mm Nylon Standoffs (Top Righ, Bottom Right, Bottom Left)
- Not listed on BOM, enough for 6 HATs (Amazon: B01HBYDH70)
- J401: 1-cell Li-Ion Battery Input
- 2500mAh/2000mAh 3.7V Battery ordered from Adafruit (Part Number: 328/2011)
- J402: Battery Jumper
- J601: RasPi Power/GPIO Header
- J602: MCU IO
- J603: 1-Wire Temperature Sensor
- J604: RasPi Reset/GPIO Header
- ASSEMBLY_COMPONENTS
- 1

## Library data of the parts
BOM701 BOM704 BOM707 = daqcs:BOM_LINE_ITEM; DATASHEET: HW/docs/projects/raspi_zero_power_sensor_hat/datasheets/connectors/uart_1wire_power_battery/050579402_sd.pdf; MANUFACTURER: Molex; MANUFACTURER_PN: 50-57-9402; VENDOR: Digi-key; VENDOR_PN: WM2900-ND
BOM702 BOM703 BOM705 BOM706 BOM708 BOM709 BOM712-BOM715 BOM717-BOM719 = daqcs:BOM_LINE_ITEM; DATASHEET: HW/docs/projects/raspi_zero_power_sensor_hat/datasheets/connectors/uart_1wire_power_battery/016020087_sd.pdf; MANUFACTURER: Molex; MANUFACTURER_PN: 0016020087; VENDOR: Digi-key; VENDOR_PN: WM2512CT-ND
BOM710 = daqcs:BOM_LINE_ITEM; DATASHEET: HW/docs/projects/raspi_zero_power_sensor_hat/datasheets/connectors/raspi_header/M20-998.pdf; MANUFACTURER: Harwin; MANUFACTURER_PN: M20-9980545; VENDOR: Digi-key; VENDOR_PN: 952-2380-ND
BOM711 = daqcs:BOM_LINE_ITEM; DATASHEET: HW/docs/projects/raspi_zero_power_sensor_hat/datasheets/connectors/uart_1wire_power_battery/050579402_sd.pdf; MANUFACTURER: Molex; MANUFACTURER_PN: 0050579404; VENDOR: Digi-key; VENDOR_PN: WM2902-ND
BOM716 = daqcs:BOM_LINE_ITEM; DATASHEET: HW/docs/projects/raspi_zero_power_sensor_hat/datasheets/connectors/uart_1wire_power_battery/050579402_sd.pdf; MANUFACTURER: Molex; MANUFACTURER_PN: 50-57-9403; VENDOR: Digi-key; VENDOR_PN: WM2901-ND
BOM720 BOM721 = daqcs:BOM_LINE_ITEM; DATASHEET: HW/docs/projects/raspi_zero_power_sensor_hat/datasheets/sensors/DS18B20.pdf; MANUFACTURER: Maxim; MANUFACTURER_PN: DS18B20+; VENDOR: Digi-key; VENDOR_PN: DS18B20+-ND
BOM722 = daqcs:BOM_LINE_ITEM; DATASHEET: HW/docs/projects/raspi_zero_power_sensor_hat/datasheets/connectors/raspi_header/M20-998.pdf; MANUFACTURER: Harwin; MANUFACTURER_PN: M20-9980345; VENDOR: Digi-key; VENDOR_PN: 952-2120-ND
C301 C401 C406-C408 = daqcs:CAP: Chip Capacitor; DATASHEET: HW/docs/projects/raspi_zero_power_sensor_hat/datasheets/passives/c02e.pdf; MANUFACTURER: Murata; MANUFACTURER_PN: GRM21BR61C106KE15L; TEMP_COEFF: X5R; TOLERANCE: 10%; VENDOR: Digi-key; VENDOR_PN: 490-3886-1-ND; VOLTAGE: 16V
C302 C402 C501-C503 C506-C508 C510-C513 C601 C602 = daqcs:CAP: Chip Capacitor; DATASHEET: HW/docs/projects/raspi_zero_power_sensor_hat/datasheets/passives/c02e.pdf; MANUFACTURER: Murata; MANUFACTURER_PN: GRM188R71C104KA01D; TEMP_COEFF: X7R; TOLERANCE: 10%; VENDOR: Digi-key; VENDOR_PN: 490-1532-1-ND; VOLTAGE: 16V
C403 = daqcs:CAP: Chip Capacitor; DATASHEET: HW/docs/projects/raspi_zero_power_sensor_hat/datasheets/passives/c02e.pdf; MANUFACTURER: Murata; MANUFACTURER_PN: GRM21BR61A226ME51L; TEMP_COEFF: X5R; TOLERANCE: 20%; VENDOR: Digi-key; VENDOR_PN: 490-10511-1-ND; VOLTAGE: 10V
C404 = daqcs:CAP: Chip Capacitor; DATASHEET: HW/docs/projects/raspi_zero_power_sensor_hat/datasheets/passives/c02e.pdf; MANUFACTURER: Murata; MANUFACTURER_PN: GRM188R61C225KE15D; TEMP_COEFF: X5R; TOLERANCE: 10%; VENDOR: Digi-key; VENDOR_PN: 490-3296-1-ND; VOLTAGE: 16V
C405 = daqcs:CAP: Chip Capacitor; DATASHEET: HW/docs/projects/raspi_zero_power_sensor_hat/datasheets/passives/c02e.pdf; MANUFACTURER: Murata; MANUFACTURER_PN: GRM188R71H183JA01D; TEMP_COEFF: X7R; TOLERANCE: 5%; VENDOR: Digi-key; VENDOR_PN: 490-12544-1-ND; VOLTAGE: 50V
C504 = daqcs:CAP: Chip Capacitor; DATASHEET: HW/docs/projects/raspi_zero_power_sensor_hat/datasheets/passives/c02e.pdf; MANUFACTURER: Murata; MANUFACTURER_PN: GRM188R61A475KE15D; TEMP_COEFF: X5R; TOLERANCE: 10%; VENDOR: Digi-key; VENDOR_PN: 490-10477-1-ND; VOLTAGE: 10V
C505 = daqcs:CAP: Chip Capacitor; DATASHEET: HW/docs/projects/raspi_zero_power_sensor_hat/datasheets/passives/c02e.pdf; MANUFACTURER: Murate; MANUFACTURER_PN: GRM188R71H103JA01D; TEMP_COEFF: X7R; TOLERANCE: 5%; VENDOR: Digi-key; VENDOR_PN: 490-9734-1-ND; VOLTAGE: 50V
C509 = daqcs:CAP: Chip Capacitor; DATASHEET: HW/docs/projects/raspi_zero_power_sensor_hat/datasheets/passives/c02e.pdf; MANUFACTURER: Murata; MANUFACTURER_PN: GRM188R61A106KE69D; TEMP_COEFF: X5R; TOLERANCE: 10%; VENDOR: Digi-key; VENDOR_PN: 490-10474-1-ND; VOLTAGE: 10V
DS301 DS402 DS601 DS602 = daqcs:LED: Chip LED; DATASHEET: HW/docs/projects/raspi_zero_power_sensor_hat/datasheets/charger/150060YS75000.pdf; FORWARD_CURRENT: 20mA; FORWARD_VOLTAGE: 2.0V; MANUFACTURER: Wurth; MANUFACTURER_PN: 150060YS75000; VENDOR: Digi-key; VENDOR_PN: 732-4981-1-ND
DS302 = daqcs:LED: Chip LED; DATASHEET: HW/docs/projects/raspi_zero_power_sensor_hat/datasheets/charger/150060GS75000.pdf; FORWARD_CURRENT: 20mA; FORWARD_VOLTAGE: 3.2V; MANUFACTURER: Wurth; MANUFACTURER_PN: 150060GS75000; VENDOR: Digi-key; VENDOR_PN: 732-4971-1-ND
DS401 = daqcs:LED: Chip LED; DATASHEET: HW/docs/projects/raspi_zero_power_sensor_hat/datasheets/charger/150060BS75000.pdf; FORWARD_CURRENT: 20mA; FORWARD_VOLTAGE: 3.2V; MANUFACTURER: Wurth; MANUFACTURER_PN: 150060BS75000; VENDOR: Digi-key; VENDOR_PN: 732-4966-1-ND
F601 = daqcs:FUSE: FUSE; CURRENT_RATING: 50mA; DATASHEET: HW/docs/projects/raspi_zero_power_sensor_hat/datasheets/passives/AccuGuardLC_0603.pdf; DC_COLD_RESISTANCE: 3.4OHM; MANUFACTURER: AVX; MANUFACTURER_PN: F0603G0R05FNTR; RESPONSE_TIME: FAST; VENDOR: Digi-key; VENDOR_PN: 478-6871-1-ND; VOLTAGE_RATING: 32Vdc
J301 J401 = daqcs:MOLSL_2PIN: Molex SL Series 2-Position Connector Wire to board 2.54 mm (.1 inch) pitch header (right-angle or vertical) Housing: Vendor=Molex, Vendor_PN=0050579402 22-24 AWG Crimp: Vendor=Molex, Vendor_PN=0016020087 Wires: AWG,Amps (Max) 22, 3.0 24, 3.0 26, 1.8 28, 1.2; DATASHEET: HW/docs/projects/raspi_zero_power_sensor_hat/datasheets/connectors/uart_1wire_power_battery/705530001_sd.pdf; FINISH: GOLD; LOCKING: YES; MANUFACTURER: Molex; MANUFACTURER_PN: 0705530001; MAX_CURRENT: 3.0A; MOUNT_ANGLE: RIGHT; MOUNT_TYPE: TH; POSITIONS: 2; VENDOR: Digi-key; VENDOR_PN: WM4900-ND
J302 = daqcs:USB: Description: 5 Pin USB Connectors. SLD is the shield connection. Usually tied to ground through a small ferrite bead.; CONTACTS: 5; DATASHEET: HW/docs/projects/raspi_zero_power_sensor_hat/datasheets/connectors/charger_power/10118193.pdf; MANUFACTURER: Amphenol; MANUFACTURER_PN: 10118193-0001LF; MOUNT_ANGLE: RIGHT; MOUNT_TYPE: TH/SMD; VENDOR: Digi-key; VENDOR_PN: 609-4616-1-ND
J402 = daqcs:MOLSL_2PIN: Molex SL Series 2-Position Connector Wire to board 2.54 mm (.1 inch) pitch header (right-angle or vertical) Housing: Vendor=Molex, Vendor_PN=0050579402 22-24 AWG Crimp: Vendor=Molex, Vendor_PN=0016020087 Wires: AWG,Amps (Max) 22, 3.0 24, 3.0 26, 1.8 28, 1.2; DATASHEET: HW/docs/projects/raspi_zero_power_sensor_hat/datasheets/connectors/uart_1wire_power_battery/705430001_sd.pdf; FINISH: GOLD; LOCKING: YES; MANUFACTURER: Molex; MANUFACTURER_PN: 0705430001; MAX_CURRENT: 3.0A; MOUNT_ANGLE: VERTICAL; MOUNT_TYPE: TH; POSITIONS: 2; VENDOR: Digi-key; VENDOR_PN: WM4800-ND
J601 = daqcs:RECEPTICAL-2X5-254MM-PIZERO: .100” [2.54 mm] Contact Centers, Female Headers, Straight/Right Angle/SMT; DATASHEET: HW/docs/projects/raspi_zero_power_sensor_hat/datasheets/connectors/raspi_header/78_P\(N\)PxCxxxLFBN-RC\,_10492-H.pdf; FINISH: GOLD; MANUFACTURER: Sullins; MANUFACTURER_PN: PPPC052LFBN-RC; MAX_CURRENT: 3.0A; MOUNT_ANGLE: VERTICAL; MOUNT_TYPE: TH; PITCH: 2.54mm; POSITIONS: 10; ROWS: 2; VENDOR: Digi-key; VENDOR_PN: S7108-ND
J602 = daqcs:MOLSL_4PIN: Molex SL Series 4-Position Connector Wire to board 2.54 mm (.1 inch) pitch header (right-angle or vertical) Housing: Vendor=Molex, Vendor_PN=0050579404 22-24 AWG Crimp: Vendor=Molex, Vendor_PN=0016020087 Wires: AWG,Amps (Max) 22, 3.0 24, 3.0 26, 1.8 28, 1.2; DATASHEET: HW/docs/projects/raspi_zero_power_sensor_hat/datasheets/connectors/uart_1wire_power_battery/705530001_sd.pdf; FINISH: GOLD; LOCKING: YES; MANUFACTURER: Molex; MANUFACTURER_PN: 0705530003; MAX_CURRENT: 3.0A; MOUNT_ANGLE: RIGHT; MOUNT_TYPE: TH; POSITIONS: 4; VENDOR: Digi-key; VENDOR_PN: WM4902-ND
J603 = daqcs:MOLSL_3PIN: Molex SL Series 3-Position Connector Wire to board 2.54 mm (.1 inch) pitch header (right-angle or vertical) Housing: Vendor=Molex, Vendor_PN=0050579403 22-24 AWG Crimp: Vendor=Molex, Vendor_PN=0016020087 Wires: AWG,Amps (Max) 22, 3.0 24, 3.0 26, 1.8 28, 1.2; DATASHEET: HW/docs/projects/raspi_zero_power_sensor_hat/datasheets/connectors/uart_1wire_power_battery/705430001_sd.pdf; FINISH: GOLD; LOCKING: YES; MANUFACTURER: Molex; MANUFACTURER_PN: 0705430002; MAX_CURRENT: 3.0A; MOUNT_ANGLE: VERTICAL; MOUNT_TYPE: TH; POSITIONS: 3; VENDOR: Digi-key; VENDOR_PN: WM4801-ND
J604 = daqcs:RECEPTICAL-2X3-254MM-PIZERO-RUN: .100” [2.54 mm] Contact Centers, Female Headers, Straight/Right Angle/SMT; DATASHEET: HW/docs/projects/raspi_zero_power_sensor_hat/datasheets/connectors/raspi_header/78_P\(N\)PxCxxxLFBN-RC\,_10492-H.pdf; FINISH: GOLD; MANUFACTURER: Sullins; MANUFACTURER_PN: PPPC032LFBN-RC; MAX_CURRENT: 3.0A; MOUNT_ANGLE: VERTICAL; MOUNT_TYPE: TH; PITCH: 2.54mm; POSITIONS: 6; ROWS: 2; VENDOR: Digi-key; VENDOR_PN: S7106-ND
L401 = daqcs:L: Surface Mount Inductor; CURRENT_DC: 11.5A; CURRENT_SAT: 11.5A; DATASHEET: HW/docs/projects/raspi_zero_power_sensor_hat/datasheets/passives/744316100.pdf; DCR_MAX: 4.75mOHM; MANUFACTURER: Wurth Electronics; MANUFACTURER_PN: 744316100; SHIELDED: YES; SRF: 158MHz; TOLERANCE: 20%; VENDOR: Digi-key; VENDOR_PN: 732-6176-1-ND
LOGO601 = daqcs:CMS_LOGO
LOGO602 = daqcs:SQUAD_LOGO
OUTLINE601 = daqcs:RASPI_ZERO_OUTLINE
Q301 Q401 = daqcs:MOSFET-NCHANNEL_DUAL: Mosfet Array 2 N-Channel (Dual) 60V 300mA 285mW Surface Mount US6; CONTINUOUS_DRAIN_CURRENT: 0.3A; DATASHEET: HW/docs/projects/raspi_zero_power_sensor_hat/datasheets/wdt_reset/SSM6N7002KFU_datasheet_en_20170112.pdf; FET_TYPE: 2 N-Channel (Dual); MANUFACTURER: Toshiba; MANUFACTURER_PN: SSM6N7002KFU,LF; POWER_MAX: 285mW; RDS_ON_MAX: 1.5 Ohm @ 100mA, 10V; VDS: 60V; VENDOR: Digi-key; VENDOR_PN: SSM6N7002KFULFCT-ND; VGS_MAX: 2.1V @ 250µA
R301 R305-R308 R401 R501-R507 R601 R602 R605 R606 R609-R612 = daqcs:RES: Chip Resistor; DATASHEET: HW/docs/projects/raspi_zero_power_sensor_hat/datasheets/passives/AOA0000C281.pdf; MANUFACTURER: Panasonic; MANUFACTURER_PN: ERJ-3GEY0R00V; POWER: 1/10W; RATED_CURRENT: 1.0A; TOLERANCE: Jmp; VENDOR: Digi-key; VENDOR_PN: P0.0GCT-ND
R302-R304 R407 R410 R603 R604 R607 R608 = daqcs:RES: Chip Resistor; DATASHEET: HW/docs/projects/raspi_zero_power_sensor_hat/datasheets/passives/AOA0000C283.pdf; MANUFACTURER: Panasonic; MANUFACTURER_PN: ERJ-3EKF2001V; POWER: 1/10W; RATED_CURRENT: 1.0A; TOLERANCE: 1%; VENDOR: Digi-key; VENDOR_PN: P2.00KHCT-ND
R309-R311 R404-R406 = daqcs:RES: Chip Resistor; DATASHEET: HW/docs/projects/raspi_zero_power_sensor_hat/datasheets/passives/AOA0000C283.pdf; MANUFACTURER: Panasonic; MANUFACTURER_PN: ERJ-3EKF1002V; POWER: 1/10W; RATED_CURRENT: 1.0A; TOLERANCE: 1%; VENDOR: Digi-key; VENDOR_PN: P10.0KHCT-ND
R312 R403 = daqcs:RES: Chip Resistor; DATASHEET: HW/docs/projects/raspi_zero_power_sensor_hat/datasheets/passives/AOA0000C283.pdf; MANUFACTURER: Panasonic; MANUFACTURER_PN: ERJ-3EKF49R9V; POWER: 1/10W; RATED_CURRENT: 1.0A; TOLERANCE: 1%; VENDOR: Digi-key; VENDOR_PN: P49.9HCT-ND
R402 = daqcs:RES_SNS: Chip Resistor; DATASHEET: HW/docs/projects/raspi_zero_power_sensor_hat/datasheets/passives/res_lvk.pdf; MANUFACTURER: Ohmite; MANUFACTURER_PN: LVK12R033DER; POWER: 1/2W; TERMINALS: 4; TOLERANCE: 0.5%; VENDOR: Digi-key; VENDOR_PN: LVK12R033DERCT-ND
R408 R409 = daqcs:RES: Chip Resistor; DATASHEET: HW/docs/projects/raspi_zero_power_sensor_hat/datasheets/passives/AOA0000C281.pdf; MANUFACTURER: Panasonic; MANUFACTURER_PN: ERJ-6GEY0R00V; POWER: 1/8W; RATED_CURRENT: 2.0A; TOLERANCE: Jumper; VENDOR: Digi-key; VENDOR_PN: P0.0ACT-ND
R613 = daqcs:RES: Chip Resistor; DATASHEET: HW/docs/projects/raspi_zero_power_sensor_hat/datasheets/passives/AOA0000C283.pdf; MANUFACTURER: Panasonic; MANUFACTURER_PN: ERJ-3EKF4701V; POWER: 1/10W; RATED_CURRENT: 1.0A; TOLERANCE: 1%; VENDOR: Digi-key; VENDOR_PN: P4.70KHCT-ND
S301 = daqcs:PB-TACTILE-4P: Tactile Switch (PushButton), SPST-NO MoM ,Top Actuated, Through Hole, 4pins; ACTUATOR_HEIGHT: 4.3mm; ACUTATOR_ORIENTATION: TOP; CIRCUIT: SPST-NO; CONTACT_RATING: 0.05A @ 24VDC; DATASHEET: HW/docs/projects/raspi_zero_power_sensor_hat/datasheets/wdt_reset/en-b3f.pdf; MANUFACTURER: Omron; MANUFACTURER_PN: B3F-1000; MOUNTING_TYPE: TH; SWITCH_FUNCTION: OFF-MOM; VENDOR: Digi-key; VENDOR_PN: SW400-ND
TP301 TP401-TP403 TP601 = daqcs:TEST_POINT_TH: Test Point (various sizes); CLIPPING: YES; COLOR: RED; DATASHEET: HW/docs/projects/raspi_zero_power_sensor_hat/datasheets/connectors/test_points/5115-5119.PDF; DIAMETER: 2.54mm; DRILL: 1.02mm; HEIGHT_BOTTOM: 3.05mm; HEIGHT_TOP: 4.57mm; INSULATED: YES; MANUFACTURER: Keystone; MANUFACTURER_PN: 5000; MOUNT_ANGLE: VERTICAL; MOUNT_TYPE: TH; PLATING: SILVER; VENDOR: Digi-key; VENDOR_PN: 36-5000-ND
TP302 TP604 = daqcs:TEST_POINT_TH: Test Point (various sizes); CLIPPING: YES; COLOR: BLACK; DATASHEET: HW/docs/projects/raspi_zero_power_sensor_hat/datasheets/connectors/test_points/5115-5119.PDF; DIAMETER: 2.54mm; DRILL: 1.02mm; HEIGHT_BOTTOM: 3.05mm; HEIGHT_TOP: 4.57mm; INSULATED: YES; MANUFACTURER: Keystone; MANUFACTURER_PN: 5001; MOUNT_ANGLE: VERTICAL; MOUNT_TYPE: TH; PLATING: SILVER; VENDOR: Digi-key; VENDOR_PN: 36-5001-ND
TP303 TP304 TP404 TP501-TP513 TP605-TP612 = daqcs:TEST_POINT_SMT: Test Point (various sizes)
TP602 = daqcs:TEST_POINT_TH: Test Point (various sizes); CLIPPING: YES; COLOR: WHITE; DATASHEET: HW/docs/projects/raspi_zero_power_sensor_hat/datasheets/connectors/test_points/5115-5119.PDF; DIAMETER: 2.54mm; DRILL: 1.02mm; HEIGHT_BOTTOM: 3.05mm; HEIGHT_TOP: 4.57mm; INSULATED: YES; MANUFACTURER: Keystone; MANUFACTURER_PN: 5002; MOUNT_ANGLE: VERTICAL; MOUNT_TYPE: TH; PLATING: SILVER; VENDOR: Digi-key; VENDOR_PN: 36-5002-ND
TP603 = daqcs:TEST_POINT_TH: Test Point (various sizes); CLIPPING: YES; COLOR: YELLOW; DATASHEET: HW/docs/projects/raspi_zero_power_sensor_hat/datasheets/connectors/test_points/5115-5119.PDF; DIAMETER: 2.54mm; DRILL: 1.02mm; HEIGHT_BOTTOM: 3.05mm; HEIGHT_TOP: 4.57mm; INSULATED: YES; MANUFACTURER: Keystone; MANUFACTURER_PN: 5004; MOUNT_ANGLE: VERTICAL; MOUNT_TYPE: TH; PLATING: SILVER; VENDOR: Digi-key; VENDOR_PN: 36-5004-ND
U301 = daqcs:MCP73831: IC, BATT CHARGER, Li-Ion Li-Polymer, 500 mA; DATASHEET: HW/docs/projects/raspi_zero_power_sensor_hat/datasheets/charger/20001984g.pdf; MANUFACTURER: Microchip; MANUFACTURER_PN: MCP73831T-2ACI/OT; VENDOR: Digi-key; VENDOR_PN: MCP73831T-2ACI/OTCT-ND
U302 = daqcs:MAX63XX: Pin-Selectable Watchdog Timer; DATASHEET: HW/docs/projects/raspi_zero_power_sensor_hat/datasheets/wdt_reset/MAX6369-MAX6374.pdf; MANUFACTURER: Maxim; MANUFACTURER_PN: MAX6371KA+T; OUTPUT_ACTIVE: Low; OUTPUT_ACTIVE_TIME: 120us (min); OUTPUT_TYPE: Open Drain; STARTUP_DELAY: 60s; TIMEOUT: Adjustable (up to 60s); VENDOR: Digikey; VENDOR_PN: MAX6371KA+TCT-ND
U401 = daqcs:TLV713: 3.3V LDO (Fixed) @ 150mA Output; DATASHEET: HW/docs/projects/raspi_zero_power_sensor_hat/datasheets/extras/tlv713p.pdf; MANUFACTURER: Texas Instruments; MANUFACTURER_PN: TLV71333PDBVR; OUTPUT_CURRENT: 150mA; OUTPUT_VOLTAGE: 3.3V; TYPE: LDO; VENDOR: Digikey; VENDOR_PN: 296-35591-1-ND
U402 = daqcs:TPS61232: Boost Switching Regulator IC Positive Fixed 5V 1 Output 4A (Switch) 10-VFDFN Exposed Pad; DATASHEET: HW/docs/projects/raspi_zero_power_sensor_hat/datasheets/boost_approved/tps61232.pdf; MANUFACTURER: Texas Instruments; MANUFACTURER_PN: TPS61232DRCR; VENDOR: Digi-key; VENDOR_PN: 296-44498-1-ND
U501 U502 = daqcs:PCT2075D: I2C-bus Fm+, 1 degree C accuracy, digital temperature sensor and thermal watchdog; DATASHEET: HW/docs/projects/raspi_zero_power_sensor_hat/datasheets/sensors/PCT2075.pdf; INTERFACE: I2C; MANUFACTURER: NXP; MANUFACTURER_PN: PCT2075D,118; RESOLUTION: 10b; VENDOR: Digi-key; VENDOR_PN: 568-10219-1-ND
U503 = daqcs:MAX11613: 12-bit SAR ADC, 94.4kSamples/s, 4-Channel Single-Ended or 2-Channel Fully Differential (MUXed), I2C Interface MAX11613EUA+ Single-Supply: 2.7V to 3.6V Ultra-Small Packages: 8-Pin μMAX Internal Reference: 2.048V (MAX11613; DATASHEET: HW/docs/projects/raspi_zero_power_sensor_hat/datasheets/extras/MAX11612-MAX11617.pdf; INTERNAL_REF: 2.048V; MANUFACTURER: Maxim; MANUFACTURER_PN: MAX11613EUA+; RESOLUTION: 12b; SAMPLE_RATE: 94.4k; VENDOR: Digi-key; VENDOR_PN: MAX11613EUA+-ND
U504 = daqcs:INA219: 26-V, Bidirectional, Zero-Drift, High-Side, I2C Out Current/Power Monitor; DATASHEET: HW/docs/projects/raspi_zero_power_sensor_hat/datasheets/sensors/ina219.pdf; MANUFACTURER: Texas Instruments; MANUFACTURER_PN: INA219AIDCNR; VENDOR: Digi-key; VENDOR_PN: 296-23770-1-ND
U505 = daqcs:LSM9DS1: iNEMO inertial module: 3D accelerometer, 3D gyroscope, 3D magnetometer 3 acceleration channels, 3 angular rate channels, 3 magnetic field channels; DATASHEET: HW/docs/projects/raspi_zero_power_sensor_hat/datasheets/sensors/en.DM00103319.pdf; FUNCTION: Accelerometer, Gyroscope, Magnetometer; INTERFACE: I2C/SPI; MANUFACTURER: STMicro; MANUFACTURER_PN: LSM9DS1TR; VENDOR: Digi-key; VENDOR_PN: 497-14946-1-ND
U506 = daqcs:MS5607: Barometric Pressure Sensor, with stainless steel cap Specs High resolution module, 20cm Fast conversion down to 1 ms Low power, 1 μA (standby < 0.15 μA) QFN package 5.0 x 3.0 x 1.0 mm3 Supply voltage 1.8 to 3.6 V Integrated digital pressure sensor (24 bit ΔΣ ADC) Operating range: 10 to 1200 mbar, -40 to +85 °C I2C and SPI interface up to 20 MHz No external components (Internal oscillator) Excellent long term stability; DATASHEET: HW/docs/projects/raspi_zero_power_sensor_hat/datasheets/sensors/ENG_DS_MS5607-02BA03_B.pdf; INTERFACE: I2C,SPI; MANUFACTURER: TE Connectivity; MANUFACTURER_PN: MS560702BA03-50; OUTPUT_BITS: 24b; PRESSURE_TYPE: Absolute; VENDOR: Digi-key; VENDOR_PN: 223-1198-1-ND
U507 = daqcs:MS5803: MS5803-05BA Miniature Altimeter and Diving Module SPECIFICATIONS High resolution module, 30cm Fast conversion down to 1 ms Low power, 1 μA (standby < 0.15 μA) Integrated digital pressure sensor (24 bit ΔΣ ADC) Supply voltage 1.8 to 3.6 V Operating range: 0 to 5 bar, -40 to +85 °C I2C and SPI interface (Mode 0,3) No external components (Internal oscillator) Excellent long term stability Hermetically sealable for outdoor devices; DATASHEET: HW/docs/projects/raspi_zero_power_sensor_hat/datasheets/sensors/ENG_DS_MS5803-05BA_B.pdf; INTERFACE: I2C,SPI; MANUFACTURER: TE Connectivity; MANUFACTURER_PN: MS580305BA01-00; OUTPUT_BITS: 24b; PRESSURE_TYPE: Absolute; VENDOR: Digi-key; VENDOR_PN: 223-1625-5-ND
U508 = daqcs:SI7021: I2C HUMIDITY AND TEMPERATURE SENSOR; ACCURACY: 3%_RH; DATASHEET: HW/docs/projects/raspi_zero_power_sensor_hat/datasheets/sensors/Si7021-A20.pdf; INTERFACE: I2C; MANUFACTURER: Silicon Labs; MANUFACTURER_PN: SI7021-A20-IM; RESPONSE_TIME: 18s; VENDOR: Digi-key; VENDOR_PN: 336-3142-5-ND

## Net classes
0 default: drill 0.381 mm, clearance 0.152 mm
1 diff_pair: width 0.178 mm, drill 0.381 mm, clearance 0.178 mm